# EAGLE design module_decode_opcodes (EAGLE 6.5.0)

## Sheet 1 of 11
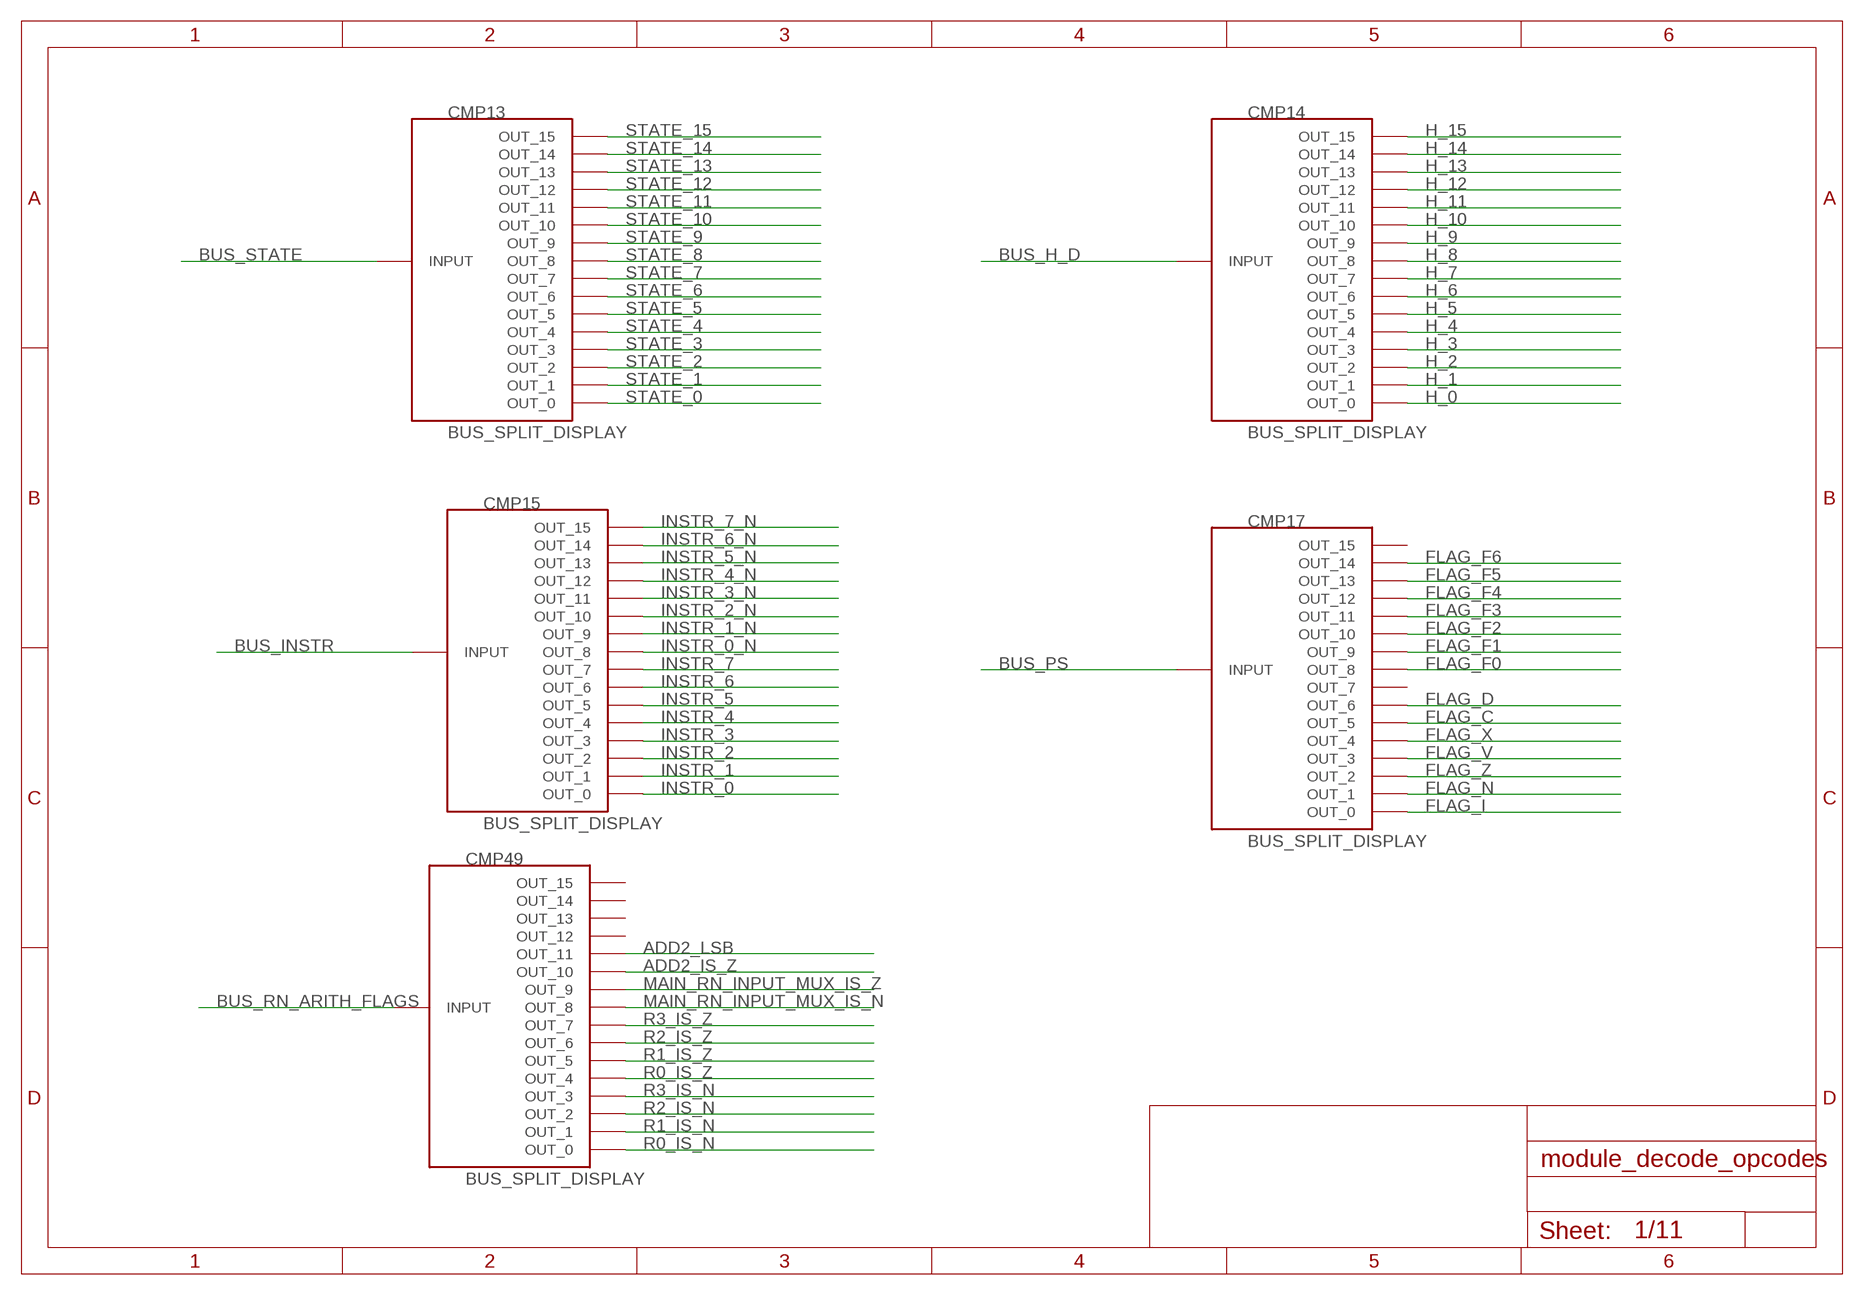
[diagram p0: schematic, sheet 1]

### Parts
CMP13  BUS_SPLIT_DISPLAY  [BUS_SPLIT_DISPLAY]
CMP14  BUS_SPLIT_DISPLAY  [BUS_SPLIT_DISPLAY]
CMP15  BUS_SPLIT_DISPLAY  [BUS_SPLIT_DISPLAY]
CMP17  BUS_SPLIT_DISPLAY  [BUS_SPLIT_DISPLAY]
CMP49  BUS_SPLIT_DISPLAY  [BUS_SPLIT_DISPLAY]

### Nets
ADD2_IS_Z: CMP49.P$11(OUT_10)
ADD2_LSB: CMP49.P$12(OUT_11)
BUS_H_D: CMP14.INPUT
BUS_INSTR: CMP15.INPUT
BUS_PS: CMP17.INPUT
BUS_RN_ARITH_FLAGS: CMP49.INPUT
BUS_STATE: CMP13.INPUT
FLAG_C: CMP17.P$6(OUT_5)
FLAG_D: CMP17.P$7(OUT_6)
FLAG_F0: CMP17.P$9(OUT_8)
FLAG_F1: CMP17.P$10(OUT_9)
FLAG_F2: CMP17.P$11(OUT_10)
FLAG_F3: CMP17.P$12(OUT_11)
FLAG_F4: CMP17.P$13(OUT_12)
FLAG_F5: CMP17.P$14(OUT_13)
FLAG_F6: CMP17.P$15(OUT_14) ; also sheet 6
FLAG_I: CMP17.P$1(OUT_0) ; also sheet 7
FLAG_N: CMP17.P$2(OUT_1)
FLAG_V: CMP17.P$4(OUT_3)
FLAG_X: CMP17.P$5(OUT_4)
FLAG_Z: CMP17.P$3(OUT_2)
H_0: CMP14.P$1(OUT_0) ; also sheet 6
H_1: CMP14.P$2(OUT_1) ; also sheet 6
H_2: CMP14.P$3(OUT_2) ; also sheet 6
H_3: CMP14.P$4(OUT_3) ; also sheet 6
H_4: CMP14.P$5(OUT_4) ; also sheet 6
H_5: CMP14.P$6(OUT_5)
H_6: CMP14.P$7(OUT_6) ; also sheet 5
H_7: CMP14.P$8(OUT_7) ; also sheet 5
H_8: CMP14.P$9(OUT_8)
H_9: CMP14.P$10(OUT_9)
H_10: CMP14.P$11(OUT_10)
H_11: CMP14.P$12(OUT_11)
H_12: CMP14.P$13(OUT_12)
H_13: CMP14.P$14(OUT_13)
H_14: CMP14.P$15(OUT_14)
H_15: CMP14.P$16(OUT_15)
INSTR_0: CMP15.P$1(OUT_0) ; also sheet 2,3,4
INSTR_0_N: CMP15.P$9(OUT_8)
INSTR_1: CMP15.P$2(OUT_1) ; also sheet 2,3,4
INSTR_1_N: CMP15.P$10(OUT_9)
INSTR_2: CMP15.P$3(OUT_2) ; also sheet 2,3,4,8
INSTR_2_N: CMP15.P$11(OUT_10) ; also sheet 8
INSTR_3: CMP15.P$4(OUT_3) ; also sheet 2,3,4
INSTR_3_N: CMP15.P$12(OUT_11) ; also sheet 4
INSTR_4: CMP15.P$5(OUT_4) ; also sheet 2,3
INSTR_4_N: CMP15.P$13(OUT_12)
INSTR_5: CMP15.P$6(OUT_5) ; also sheet 2,3
INSTR_5_N: CMP15.P$14(OUT_13)
INSTR_6: CMP15.P$7(OUT_6) ; also sheet 2,3,4
INSTR_6_N: CMP15.P$15(OUT_14) ; also sheet 8
INSTR_7: CMP15.P$8(OUT_7) ; also sheet 2,4,8
INSTR_7_N: CMP15.P$16(OUT_15) ; also sheet 3,7
MAIN_RN_INPUT_MUX_IS_N: CMP49.P$9(OUT_8)
MAIN_RN_INPUT_MUX_IS_Z: CMP49.P$10(OUT_9)
R0_IS_N: CMP49.P$1(OUT_0)
R0_IS_Z: CMP49.P$5(OUT_4)
R1_IS_N: CMP49.P$2(OUT_1)
R1_IS_Z: CMP49.P$6(OUT_5) ; also sheet 6
R2_IS_N: CMP49.P$3(OUT_2)
R2_IS_Z: CMP49.P$7(OUT_6)
R3_IS_N: CMP49.P$4(OUT_3)
R3_IS_Z: CMP49.P$8(OUT_7)
STATE_0: CMP13.P$1(OUT_0) ; also sheet 8
STATE_1: CMP13.P$2(OUT_1) ; also sheet 8
STATE_2: CMP13.P$3(OUT_2) ; also sheet 6
STATE_3: CMP13.P$4(OUT_3) ; also sheet 7
STATE_4: CMP13.P$5(OUT_4)
STATE_5: CMP13.P$6(OUT_5) ; also sheet 7
STATE_6: CMP13.P$7(OUT_6)
STATE_7: CMP13.P$8(OUT_7) ; also sheet 7
STATE_8: CMP13.P$9(OUT_8)
STATE_9: CMP13.P$10(OUT_9)
STATE_10: CMP13.P$11(OUT_10)
STATE_11: CMP13.P$12(OUT_11)
STATE_12: CMP13.P$13(OUT_12)
STATE_13: CMP13.P$14(OUT_13)
STATE_14: CMP13.P$15(OUT_14)
STATE_15: CMP13.P$16(OUT_15)
Unconnected: CMP17.P$8(OUT_7) CMP17.P$16(OUT_15) CMP49.P$13(OUT_12) CMP49.P$14(OUT_13) CMP49.P$15(OUT_14) CMP49.P$16(OUT_15)

## Sheet 2 of 11
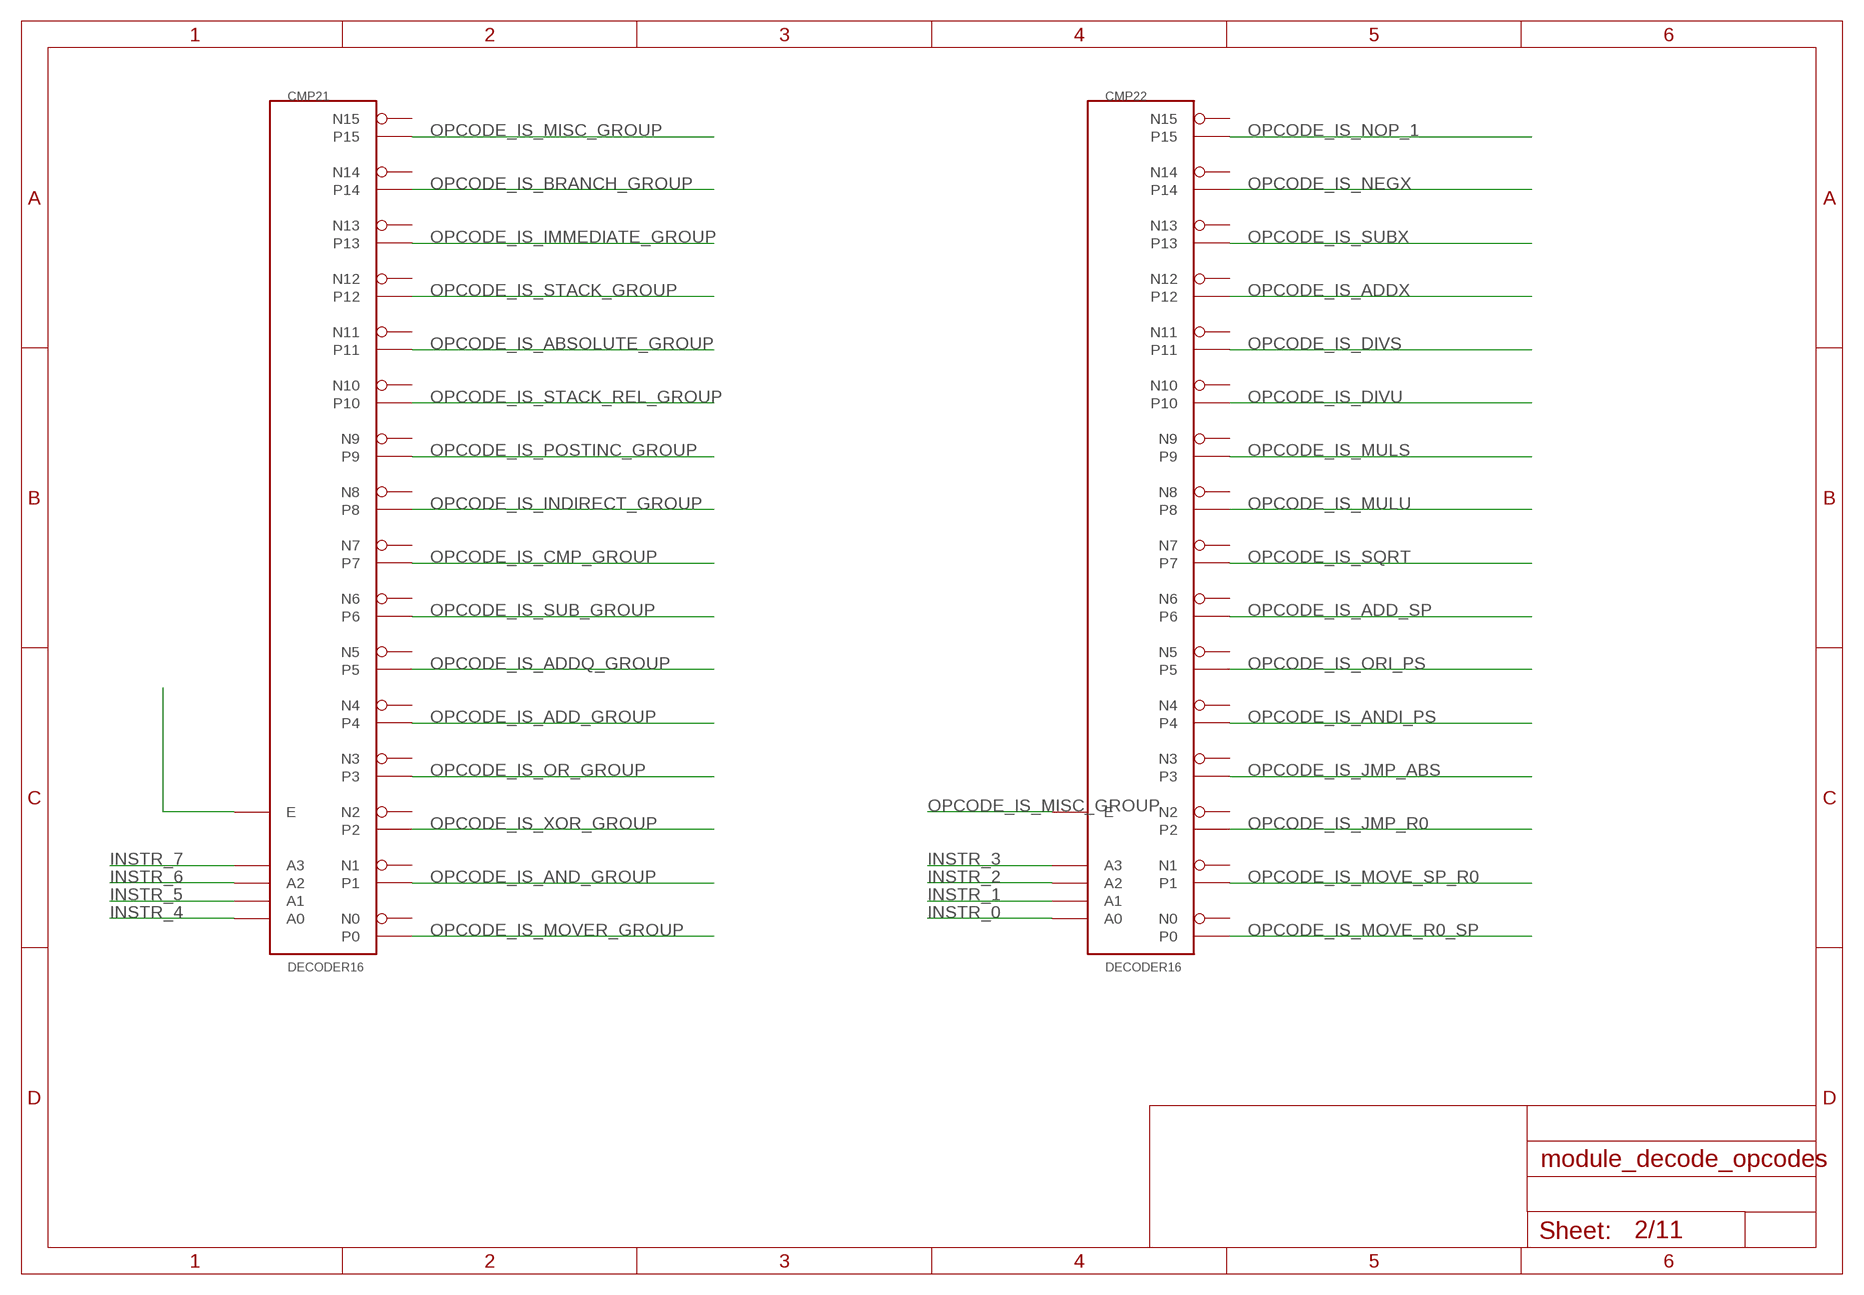
[diagram p1: schematic, sheet 2]

### Parts
CMP21  DECODER16  [DECODER16]
CMP22  DECODER16  [DECODER16]

### Nets
INSTR_0: CMP22.A0 ; also sheet 1,3,4
INSTR_1: CMP22.A1 ; also sheet 1,3,4
INSTR_2: CMP22.A2 ; also sheet 1,3,4,8
INSTR_3: CMP22.A3 ; also sheet 1,3,4
INSTR_4: CMP21.A0 ; also sheet 1,3
INSTR_5: CMP21.A1 ; also sheet 1,3
INSTR_6: CMP21.A2 ; also sheet 1,3,4
INSTR_7: CMP21.A3 ; also sheet 1,4,8
N$22: CMP21.E
OPCODE_IS_ABSOLUTE_GROUP: CMP21.P11 ; also sheet 9
OPCODE_IS_ADD_GROUP: CMP21.P4 ; also sheet 9
OPCODE_IS_ADD_SP: CMP22.P6 ; also sheet 9
OPCODE_IS_ADDQ_GROUP: CMP21.P5 ; also sheet 9
OPCODE_IS_ADDX: CMP22.P12 ; also sheet 5,9
OPCODE_IS_AND_GROUP: CMP21.P1 ; also sheet 9
OPCODE_IS_ANDI_PS: CMP22.P4 ; also sheet 9
OPCODE_IS_BRANCH_GROUP: CMP21.P14 ; also sheet 9
OPCODE_IS_CMP_GROUP: CMP21.P7 ; also sheet 9
OPCODE_IS_DIVS: CMP22.P11 ; also sheet 5,9
OPCODE_IS_DIVU: CMP22.P10 ; also sheet 5
OPCODE_IS_IMMEDIATE_GROUP: CMP21.P13 ; also sheet 4
OPCODE_IS_INDIRECT_GROUP: CMP21.P8 ; also sheet 6,9
OPCODE_IS_JMP_ABS: CMP22.P3 ; also sheet 9
OPCODE_IS_JMP_R0: CMP22.P2 ; also sheet 9
OPCODE_IS_MISC_GROUP: CMP21.P15 CMP22.E
OPCODE_IS_MOVE_R0_SP: CMP22.P0 ; also sheet 9
OPCODE_IS_MOVE_SP_R0: CMP22.P1 ; also sheet 9
OPCODE_IS_MOVER_GROUP: CMP21.P0
OPCODE_IS_MULS: CMP22.P9 ; also sheet 5,9
OPCODE_IS_MULU: CMP22.P8 ; also sheet 5,9
OPCODE_IS_NEGX: CMP22.P14 ; also sheet 5,9
OPCODE_IS_NOP_1: CMP22.P15 ; also sheet 5
OPCODE_IS_OR_GROUP: CMP21.P3 ; also sheet 9
OPCODE_IS_ORI_PS: CMP22.P5 ; also sheet 9
OPCODE_IS_POSTINC_GROUP: CMP21.P9 ; also sheet 6,9
OPCODE_IS_SQRT: CMP22.P7 ; also sheet 5,9
OPCODE_IS_STACK_GROUP: CMP21.P12 ; also sheet 3,4,9
OPCODE_IS_STACK_REL_GROUP: CMP21.P10 ; also sheet 7,9
OPCODE_IS_SUB_GROUP: CMP21.P6 ; also sheet 9
OPCODE_IS_SUBX: CMP22.P13 ; also sheet 5,9
OPCODE_IS_XOR_GROUP: CMP21.P2 ; also sheet 9
Unconnected: CMP21.N0 CMP21.N1 CMP21.N2 CMP21.N3 CMP21.N4 CMP21.N5 CMP21.N6 CMP21.N7 CMP21.N8 CMP21.N9 CMP21.N10 CMP21.N11 CMP21.N12 CMP21.N13 CMP21.N14 CMP21.N15 CMP22.N0 CMP22.N1 CMP22.N2 CMP22.N3 CMP22.N4 CMP22.N5 CMP22.N6 CMP22.N7 CMP22.N8 CMP22.N9 CMP22.N10 CMP22.N11 CMP22.N12 CMP22.N13 CMP22.N14 CMP22.N15

## Sheet 3 of 11
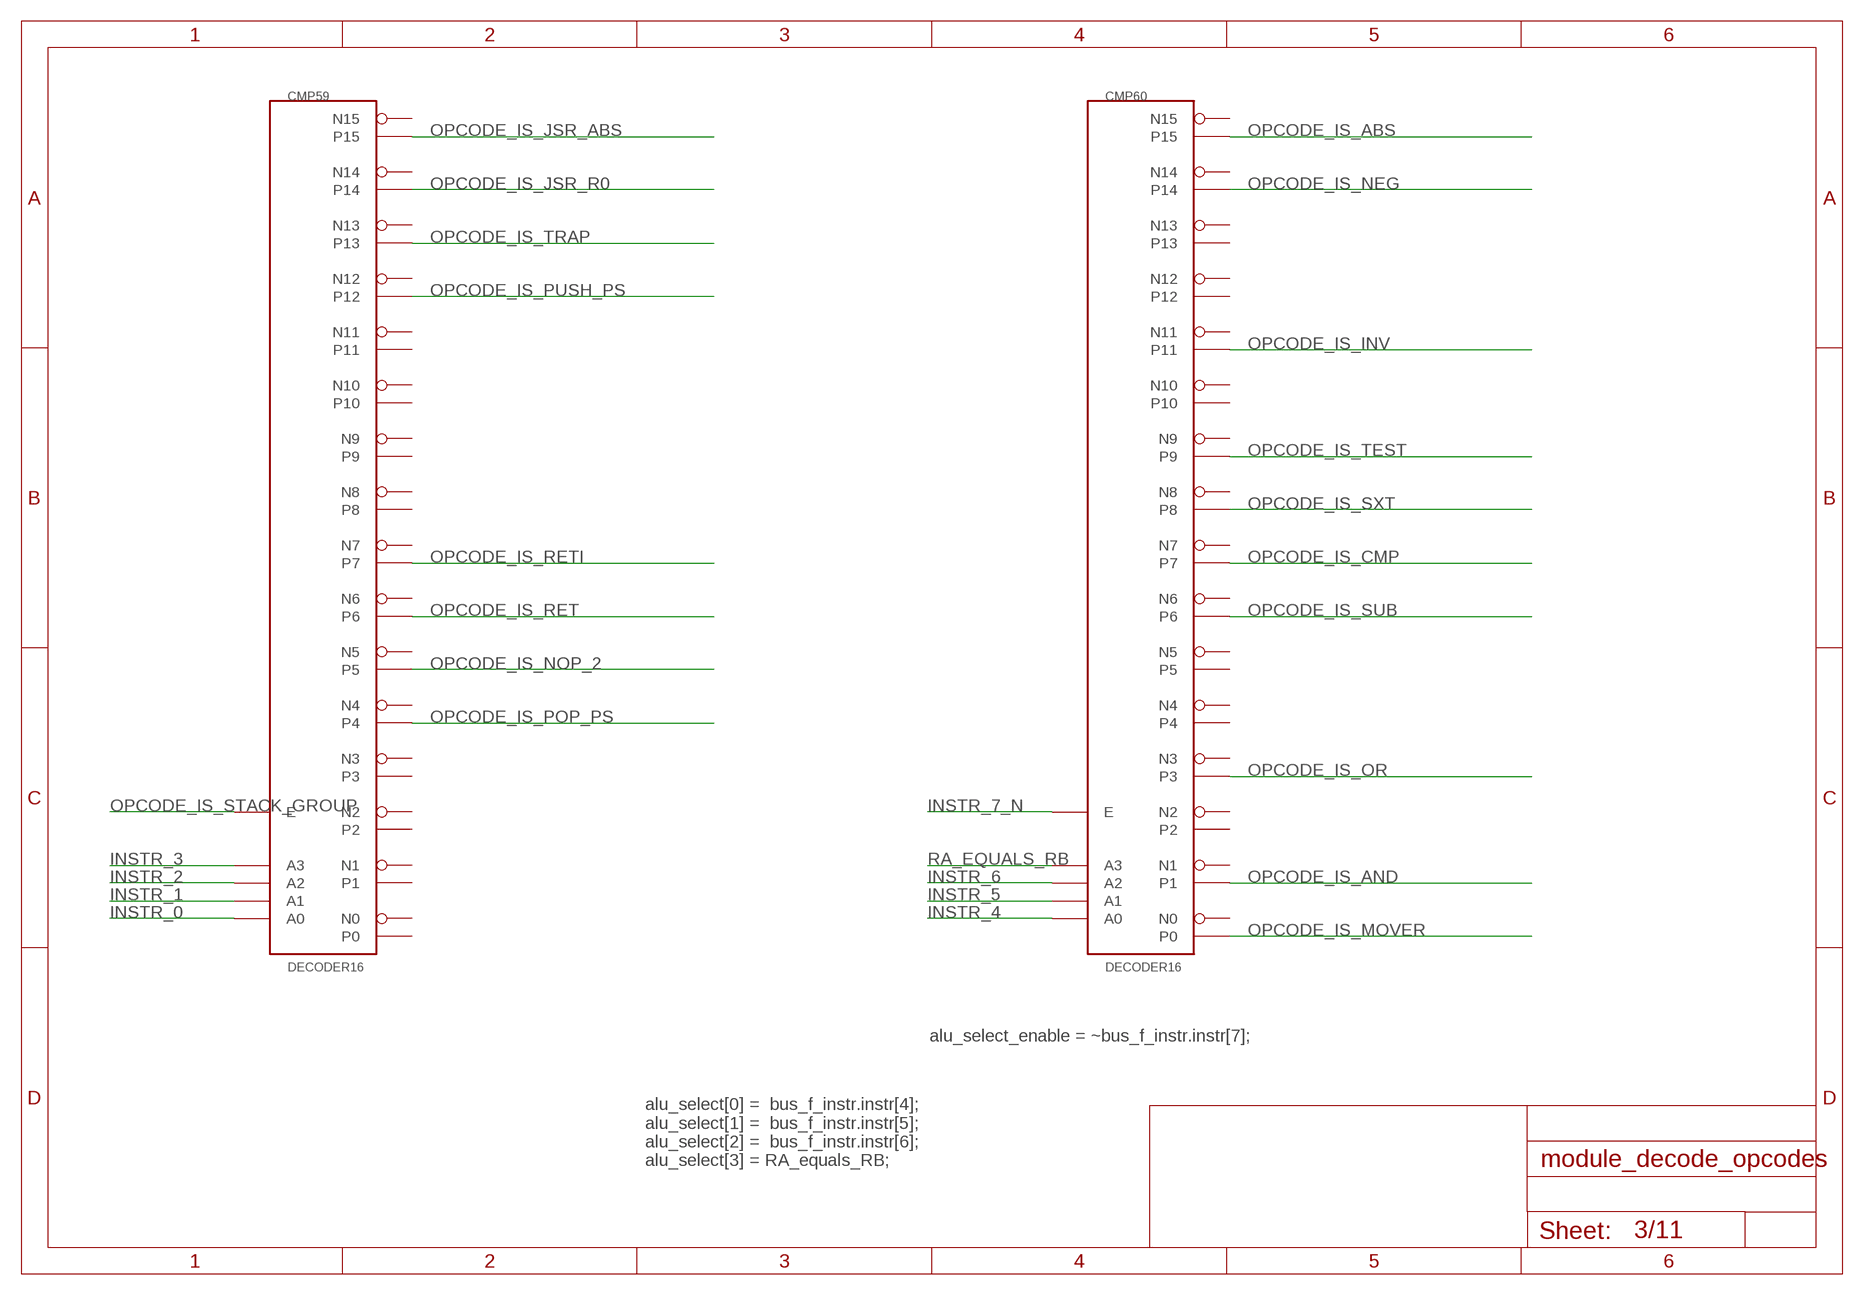
[diagram p2: schematic, sheet 3]

### Parts
CMP59  DECODER16  [DECODER16]
CMP60  DECODER16  [DECODER16]

### Nets
INSTR_0: CMP59.A0 ; also sheet 1,2,4
INSTR_1: CMP59.A1 ; also sheet 1,2,4
INSTR_2: CMP59.A2 ; also sheet 1,2,4,8
INSTR_3: CMP59.A3 ; also sheet 1,2,4
INSTR_4: CMP60.A0 ; also sheet 1,2
INSTR_5: CMP60.A1 ; also sheet 1,2
INSTR_6: CMP60.A2 ; also sheet 1,2,4
INSTR_7_N: CMP60.E ; also sheet 1,7
OPCODE_IS_ABS: CMP60.P15 ; also sheet 10
OPCODE_IS_AND: CMP60.P1
OPCODE_IS_CMP: CMP60.P7 ; also sheet 10
OPCODE_IS_INV: CMP60.P11 ; also sheet 10
OPCODE_IS_JSR_ABS: CMP59.P15 ; also sheet 5,10
OPCODE_IS_JSR_R0: CMP59.P14 ; also sheet 5,10
OPCODE_IS_MOVER: CMP60.P0 ; also sheet 10
OPCODE_IS_NEG: CMP60.P14 ; also sheet 10
OPCODE_IS_NOP_2: CMP59.P5 ; also sheet 5
OPCODE_IS_OR: CMP60.P3 ; also sheet 10
OPCODE_IS_POP_PS: CMP59.P4 ; also sheet 7,10
OPCODE_IS_PUSH_PS: CMP59.P12 ; also sheet 7,10
OPCODE_IS_RET: CMP59.P6 ; also sheet 10
OPCODE_IS_RETI: CMP59.P7 ; also sheet 10
OPCODE_IS_STACK_GROUP: CMP59.E ; also sheet 2,4,9
OPCODE_IS_SUB: CMP60.P6 ; also sheet 10
OPCODE_IS_SXT: CMP60.P8 ; also sheet 10
OPCODE_IS_TEST: CMP60.P9 ; also sheet 10
OPCODE_IS_TRAP: CMP59.P13 ; also sheet 7,10
RA_EQUALS_RB: CMP60.A3 ; also sheet 4
Unconnected: CMP59.N0 CMP59.N1 CMP59.N2 CMP59.N3 CMP59.N4 CMP59.N5 CMP59.N6 CMP59.N7 CMP59.N8 CMP59.N9 CMP59.N10 CMP59.N11 CMP59.N12 CMP59.N13 CMP59.N14 CMP59.N15 CMP59.P0 CMP59.P1 CMP59.P2 CMP59.P3 CMP59.P8 CMP59.P9 CMP59.P10 CMP59.P11 CMP60.N0 CMP60.N1 CMP60.N2 CMP60.N3 CMP60.N4 CMP60.N5 CMP60.N6 CMP60.N7 CMP60.N8 CMP60.N9 CMP60.N10 CMP60.N11 CMP60.N12 CMP60.N13 CMP60.N14 CMP60.N15 CMP60.P2 CMP60.P4 CMP60.P5 CMP60.P10 CMP60.P12 CMP60.P13

### Notes on the sheet
- alu_select_enable = ~bus_f_instr.instr[7];
- alu_select[0] =  bus_f_instr.instr[4];
      alu_select[1] =  bus_f_instr.instr[5];
      alu_select[2] =  bus_f_instr.instr[6];
      alu_select[3] = RA_equals_RB;

## Sheet 4 of 11
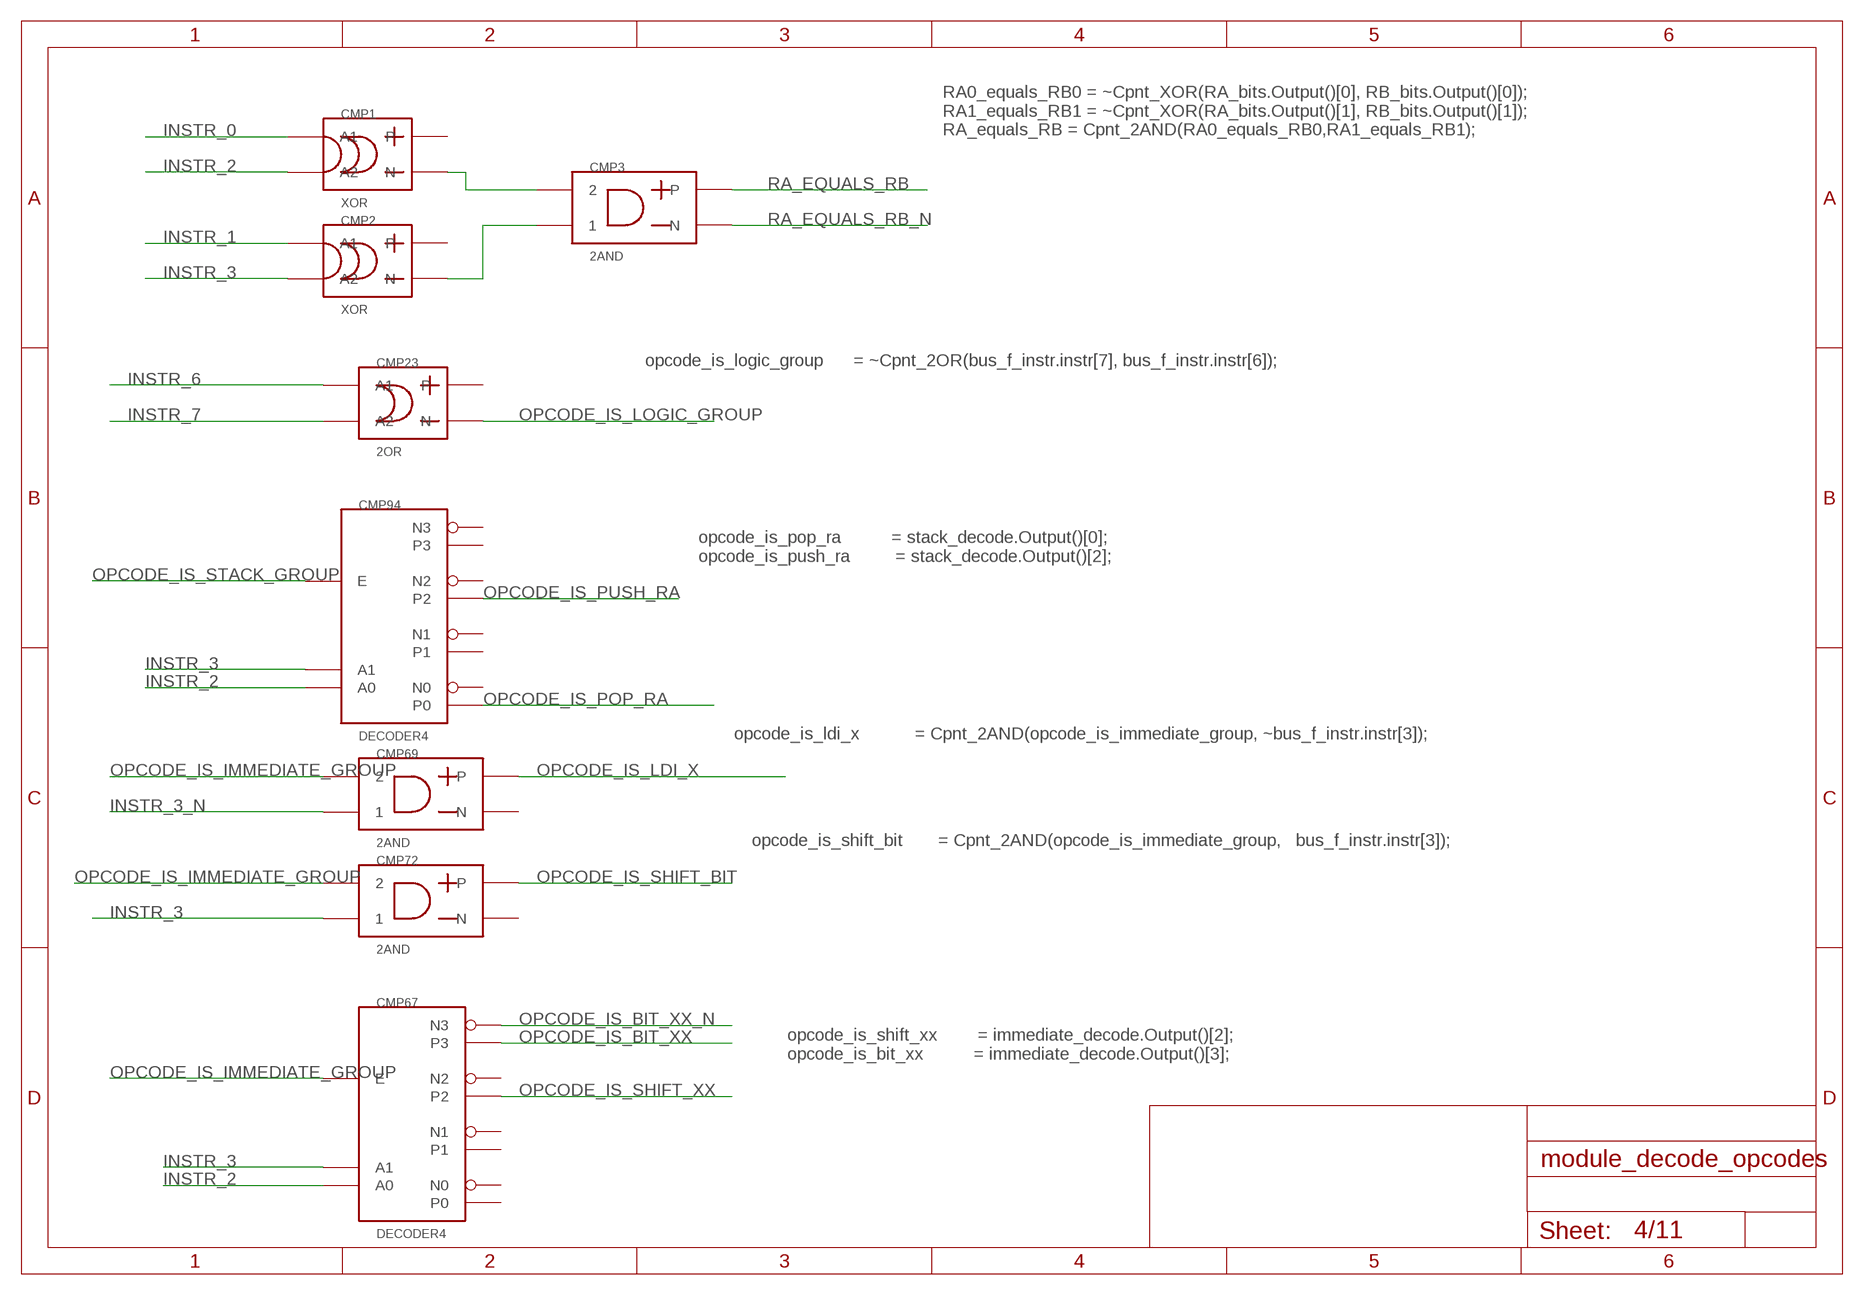
[diagram p3: schematic, sheet 4]

### Parts
CMP1  XOR  [XOR]
CMP2  XOR  [XOR]
CMP3  2AND  [2AND]
CMP23  2OR  [2OR]
CMP67  DECODER4  [DECODER4]
CMP69  2AND  [2AND]
CMP72  2AND  [2AND]
CMP94  DECODER4  [DECODER4]

### Nets
INSTR_0: CMP1.P$1(A1) ; also sheet 1,2,3
INSTR_1: CMP2.P$1(A1) ; also sheet 1,2,3
INSTR_2: CMP1.P$2(A2) CMP67.A0 CMP94.A0 ; also sheet 1,2,3,8
INSTR_3: CMP2.P$2(A2) CMP67.A1 CMP72.P$1 CMP94.A1 ; also sheet 1,2,3
INSTR_3_N: CMP69.P$1 ; also sheet 1
INSTR_6: CMP23.P$2(A1) ; also sheet 1,2,3
INSTR_7: CMP23.P$1(A2) ; also sheet 1,2,8
N$6: CMP1.OUT_N(N) CMP3.P$2
N$7: CMP2.OUT_N(N) CMP3.P$1
OPCODE_IS_BIT_XX: CMP67.P3 ; also sheet 10
OPCODE_IS_BIT_XX_N: CMP67.N3 ; also sheet 10
OPCODE_IS_IMMEDIATE_GROUP: CMP67.E CMP69.P$2 CMP72.P$2 ; also sheet 2
OPCODE_IS_LDI_X: CMP69.OUT_P(P) ; also sheet 8,10
OPCODE_IS_LOGIC_GROUP: CMP23.OUT_M(N) ; also sheet 9
OPCODE_IS_POP_RA: CMP94.P0 ; also sheet 7,8,10
OPCODE_IS_PUSH_RA: CMP94.P2 ; also sheet 7,8,10
OPCODE_IS_SHIFT_BIT: CMP72.OUT_P(P) ; also sheet 10
OPCODE_IS_SHIFT_XX: CMP67.P2 ; also sheet 6,10
OPCODE_IS_STACK_GROUP: CMP94.E ; also sheet 2,3,9
RA_EQUALS_RB: CMP3.OUT_P(P) ; also sheet 3
RA_EQUALS_RB_N: CMP3.OUT_M(N)
Unconnected: CMP1.OUT_P(P) CMP2.OUT_P(P) CMP23.OUT_P(P) CMP67.N0 CMP67.N1 CMP67.N2 CMP67.P0 CMP67.P1 CMP69.OUT_M(N) CMP72.OUT_M(N) CMP94.N0 CMP94.N1 CMP94.N2 CMP94.N3 CMP94.P1 CMP94.P3

### Notes on the sheet
- RA0_equals_RB0 = ~Cpnt_XOR(RA_bits.Output()[0], RB_bits.Output()[0]);
     RA1_equals_RB1 = ~Cpnt_XOR(RA_bits.Output()[1], RB_bits.Output()[1]);
     RA_equals_RB = Cpnt_2AND(RA0_equals_RB0,RA1_equals_RB1);
- opcode_is_logic_group      = ~Cpnt_2OR(bus_f_instr.instr[7], bus_f_instr.instr[6]);
- opcode_is_pop_ra          = stack_decode.Output()[0];
      opcode_is_push_ra         = stack_decode.Output()[2];
- opcode_is_ldi_x           = Cpnt_2AND(opcode_is_immediate_group, ~bus_f_instr.instr[3]);
- opcode_is_shift_bit       = Cpnt_2AND(opcode_is_immediate_group,   bus_f_instr.instr[3]);
- opcode_is_shift_xx        = immediate_decode.Output()[2];
      opcode_is_bit_xx          = immediate_decode.Output()[3];

## Sheet 5 of 11
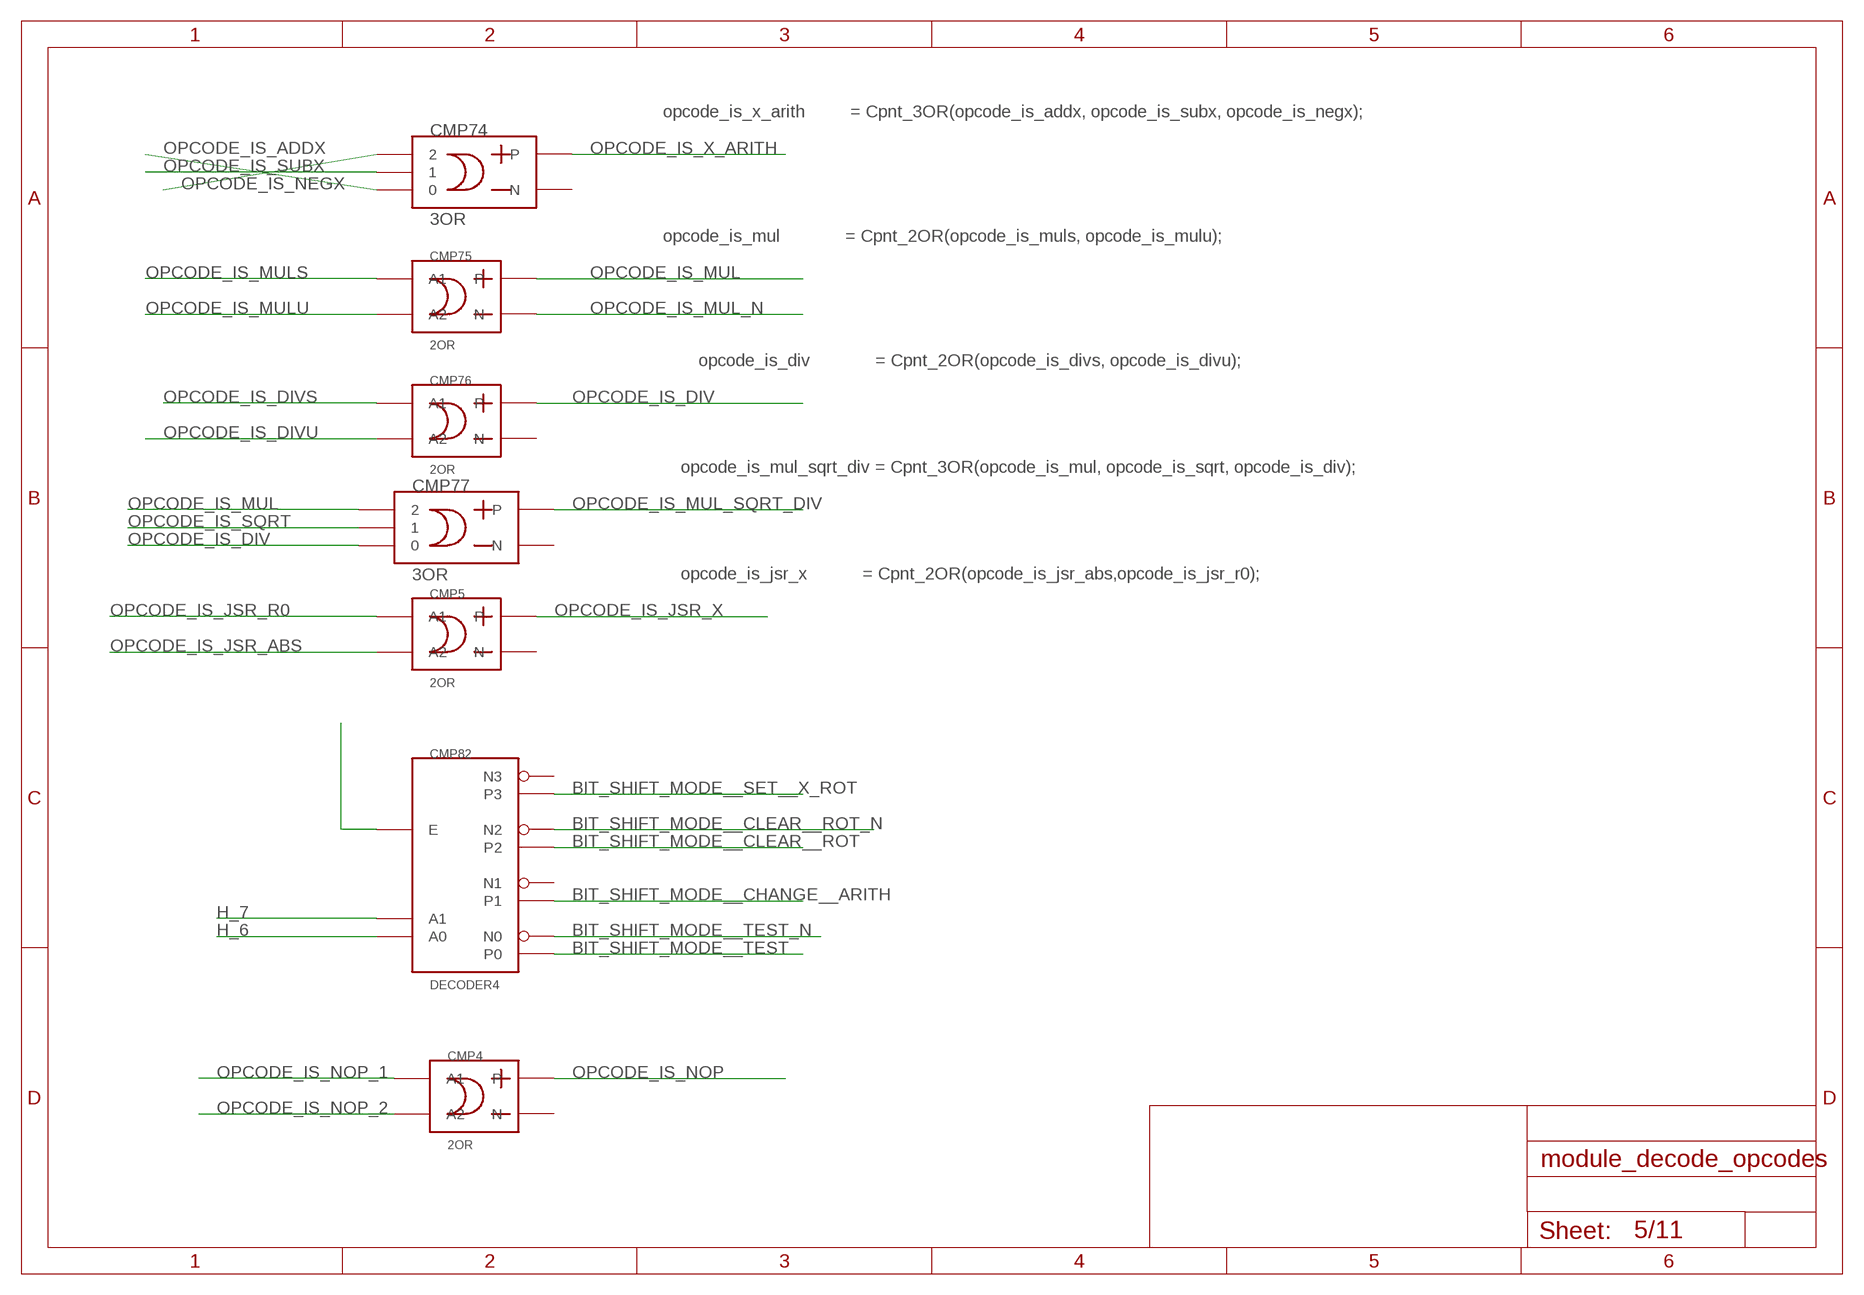
[diagram p4: schematic, sheet 5]

### Parts
CMP4  2OR  [2OR]
CMP5  2OR  [2OR]
CMP74  3OR  [3OR]
CMP75  2OR  [2OR]
CMP76  2OR  [2OR]
CMP77  3OR  [3OR]
CMP82  DECODER4  [DECODER4]

### Nets
BIT_SHIFT_MODE__CHANGE__ARITH: CMP82.P1 ; also sheet 10
BIT_SHIFT_MODE__CLEAR__ROT: CMP82.P2
BIT_SHIFT_MODE__CLEAR__ROT_N: CMP82.N2 ; also sheet 10
BIT_SHIFT_MODE__SET__X_ROT: CMP82.P3 ; also sheet 10
BIT_SHIFT_MODE__TEST: CMP82.P0
BIT_SHIFT_MODE__TEST_N: CMP82.N0 ; also sheet 10
H_6: CMP82.A0 ; also sheet 1
H_7: CMP82.A1 ; also sheet 1
N$26: CMP82.E
OPCODE_IS_ADDX: CMP74.P$1 ; also sheet 2,9
OPCODE_IS_DIV: CMP76.OUT_P(P) CMP77.P$1 ; also sheet 6,9
OPCODE_IS_DIVS: CMP76.P$2(A1) ; also sheet 2,9
OPCODE_IS_DIVU: CMP76.P$1(A2) ; also sheet 2
OPCODE_IS_JSR_ABS: CMP5.P$1(A2) ; also sheet 3,10
OPCODE_IS_JSR_R0: CMP5.P$2(A1) ; also sheet 3,10
OPCODE_IS_JSR_X: CMP5.OUT_P(P) ; also sheet 11
OPCODE_IS_MUL: CMP75.OUT_P(P) CMP77.P$3
OPCODE_IS_MUL_N: CMP75.OUT_M(N) ; also sheet 9
OPCODE_IS_MUL_SQRT_DIV: CMP77.OUT_P(P) ; also sheet 10
OPCODE_IS_MULS: CMP75.P$2(A1) ; also sheet 2,9
OPCODE_IS_MULU: CMP75.P$1(A2) ; also sheet 2,9
OPCODE_IS_NEGX: CMP74.P$3 ; also sheet 2,9
OPCODE_IS_NOP: CMP4.OUT_P(P) ; also sheet 7,10
OPCODE_IS_NOP_1: CMP4.P$2(A1) ; also sheet 2
OPCODE_IS_NOP_2: CMP4.P$1(A2) ; also sheet 3
OPCODE_IS_SQRT: CMP77.P$2 ; also sheet 2,9
OPCODE_IS_SUBX: CMP74.P$2 ; also sheet 2,9
OPCODE_IS_X_ARITH: CMP74.OUT_P(P) ; also sheet 7,10
Unconnected: CMP4.OUT_M(N) CMP5.OUT_M(N) CMP74.OUT_M(N) CMP76.OUT_M(N) CMP77.OUT_M(N) CMP82.N1 CMP82.N3

### Notes on the sheet
- opcode_is_x_arith         = Cpnt_3OR(opcode_is_addx, opcode_is_subx, opcode_is_negx);
- opcode_is_mul             = Cpnt_2OR(opcode_is_muls, opcode_is_mulu);
- opcode_is_div             = Cpnt_2OR(opcode_is_divs, opcode_is_divu);
- opcode_is_mul_sqrt_div = Cpnt_3OR(opcode_is_mul, opcode_is_sqrt, opcode_is_div);
- opcode_is_jsr_x           = Cpnt_2OR(opcode_is_jsr_abs,opcode_is_jsr_r0);

## Sheet 6 of 11
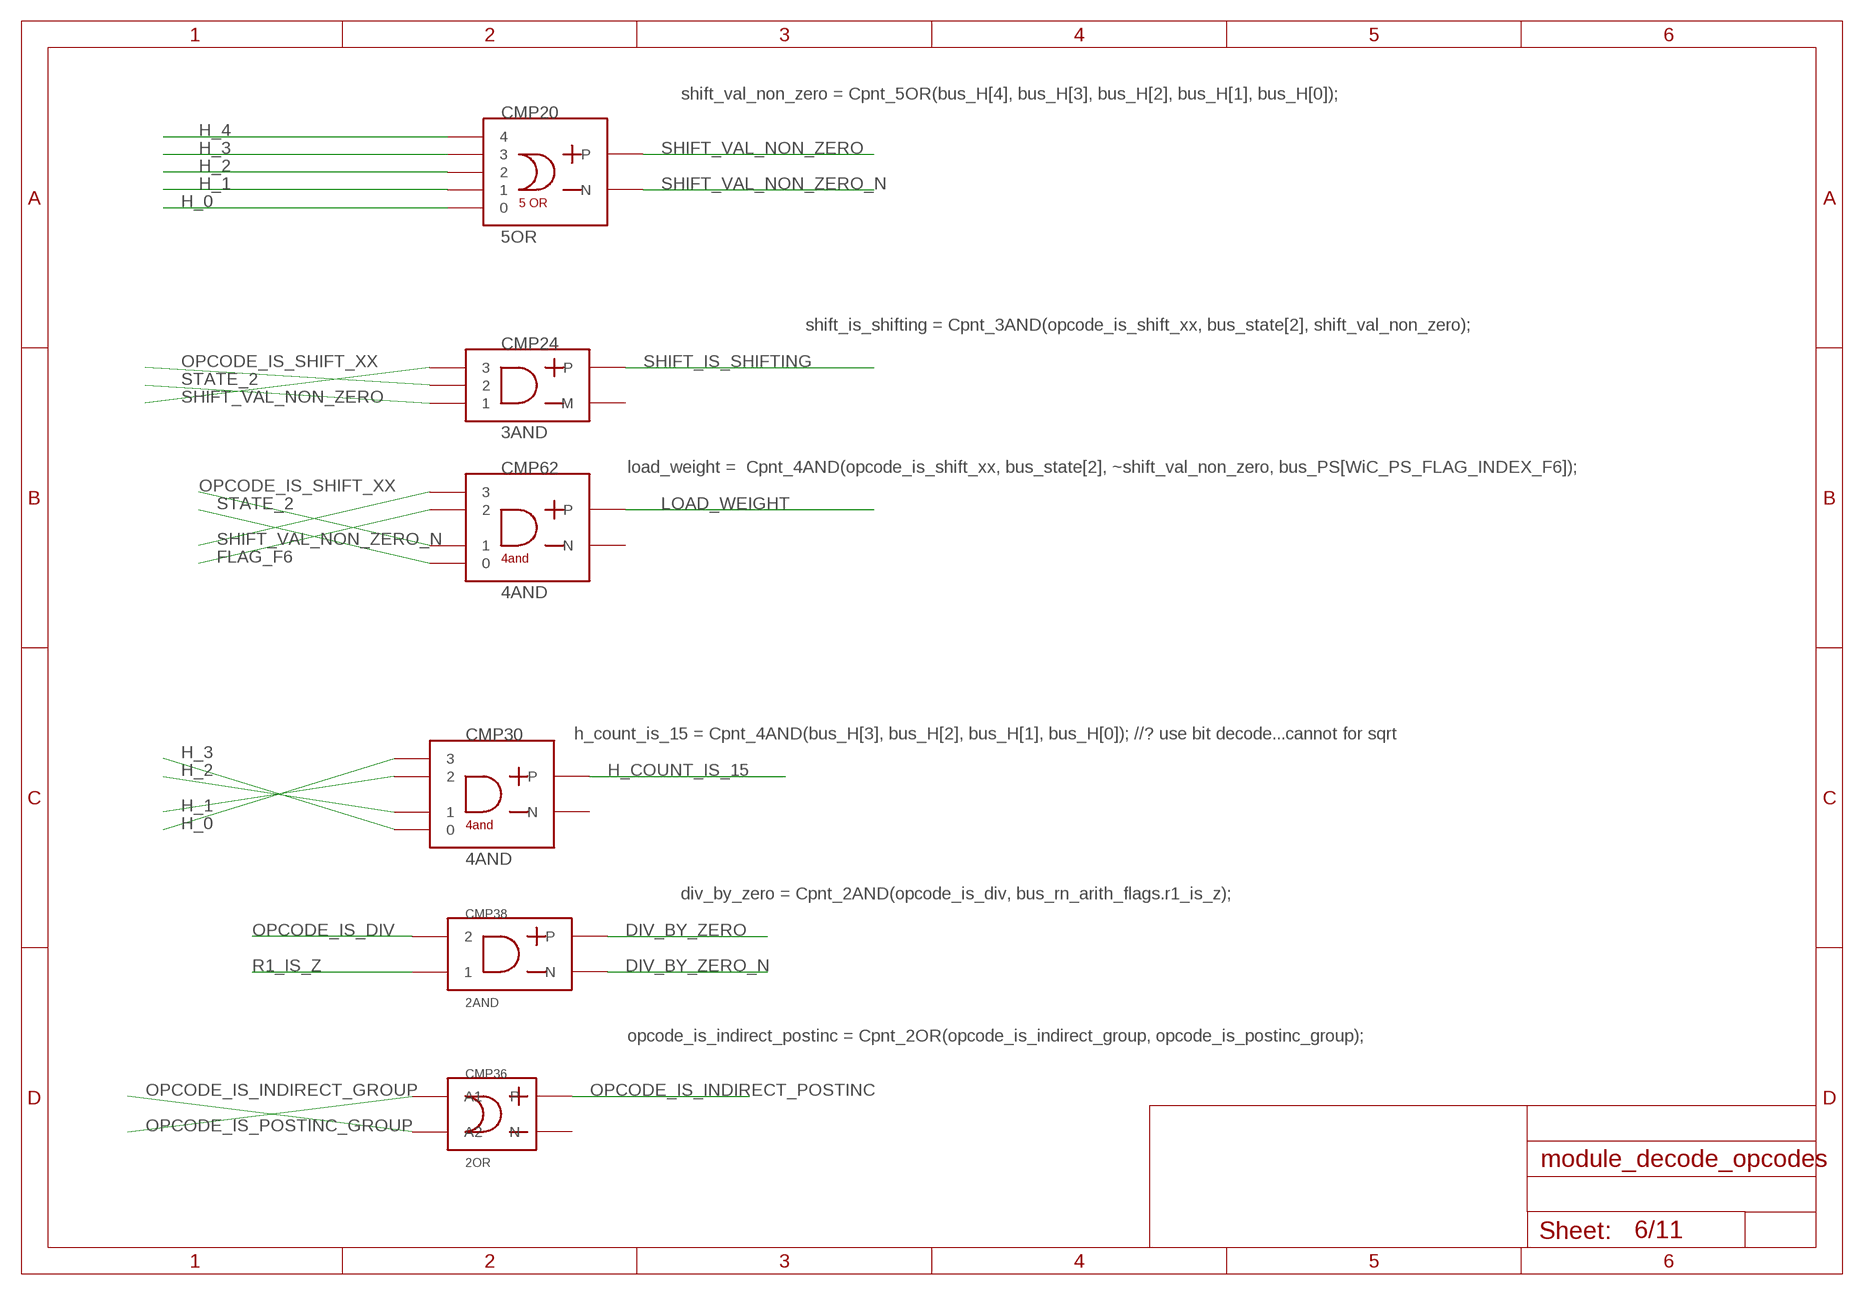
[diagram p5: schematic, sheet 6]

### Parts
CMP20  5OR  [5OR]
CMP24  3AND  [3AND]
CMP30  4AND  [4AND]
CMP36  2OR  [2OR]
CMP38  2AND  [2AND]
CMP62  4AND  [4AND]

### Nets
DIV_BY_ZERO: CMP38.OUT_P(P) ; also sheet 10
DIV_BY_ZERO_N: CMP38.OUT_M(N) ; also sheet 10
FLAG_F6: CMP62.P$3 ; also sheet 1
H_0: CMP20.1 CMP30.P$4 ; also sheet 1
H_1: CMP20.2 CMP30.P$3 ; also sheet 1
H_2: CMP20.3 CMP30.P$2 ; also sheet 1
H_3: CMP20.4 CMP30.P$1 ; also sheet 1
H_4: CMP20.5 ; also sheet 1
H_COUNT_IS_15: CMP30.OUT_P(P) ; also sheet 11
LOAD_WEIGHT: CMP62.OUT_P(P) ; also sheet 11
OPCODE_IS_DIV: CMP38.P$2 ; also sheet 5,9
OPCODE_IS_INDIRECT_GROUP: CMP36.P$1(A2) ; also sheet 2,9
OPCODE_IS_INDIRECT_POSTINC: CMP36.OUT_P(P) ; also sheet 7,9
OPCODE_IS_POSTINC_GROUP: CMP36.P$2(A1) ; also sheet 2,9
OPCODE_IS_SHIFT_XX: CMP24.P$2 CMP62.P$2 ; also sheet 4,10
R1_IS_Z: CMP38.P$1 ; also sheet 1
SHIFT_IS_SHIFTING: CMP24.OUT_P(P) ; also sheet 11
SHIFT_VAL_NON_ZERO: CMP20.OUT_P(P) CMP24.P$3 ; also sheet 11
SHIFT_VAL_NON_ZERO_N: CMP20.OUT_M(N) CMP62.P$4 ; also sheet 11
STATE_2: CMP24.P$1 CMP62.P$1 ; also sheet 1
Unconnected: CMP24.OUT_M(M) CMP30.OUT_M(N) CMP36.OUT_M(N) CMP62.OUT_M(N)

### Notes on the sheet
- shift_val_non_zero = Cpnt_5OR(bus_H[4], bus_H[3], bus_H[2], bus_H[1], bus_H[0]);
- shift_is_shifting = Cpnt_3AND(opcode_is_shift_xx, bus_state[2], shift_val_non_zero);
- load_weight =  Cpnt_4AND(opcode_is_shift_xx, bus_state[2], ~shift_val_non_zero, bus_PS[WiC_PS_FLAG_INDEX_F6]);
- h_count_is_15 = Cpnt_4AND(bus_H[3], bus_H[2], bus_H[1], bus_H[0]); //? use bit decode...cannot for sqrt
- div_by_zero = Cpnt_2AND(opcode_is_div, bus_rn_arith_flags.r1_is_z);
- opcode_is_indirect_postinc = Cpnt_2OR(opcode_is_indirect_group, opcode_is_postinc_group);

## Sheet 7 of 11
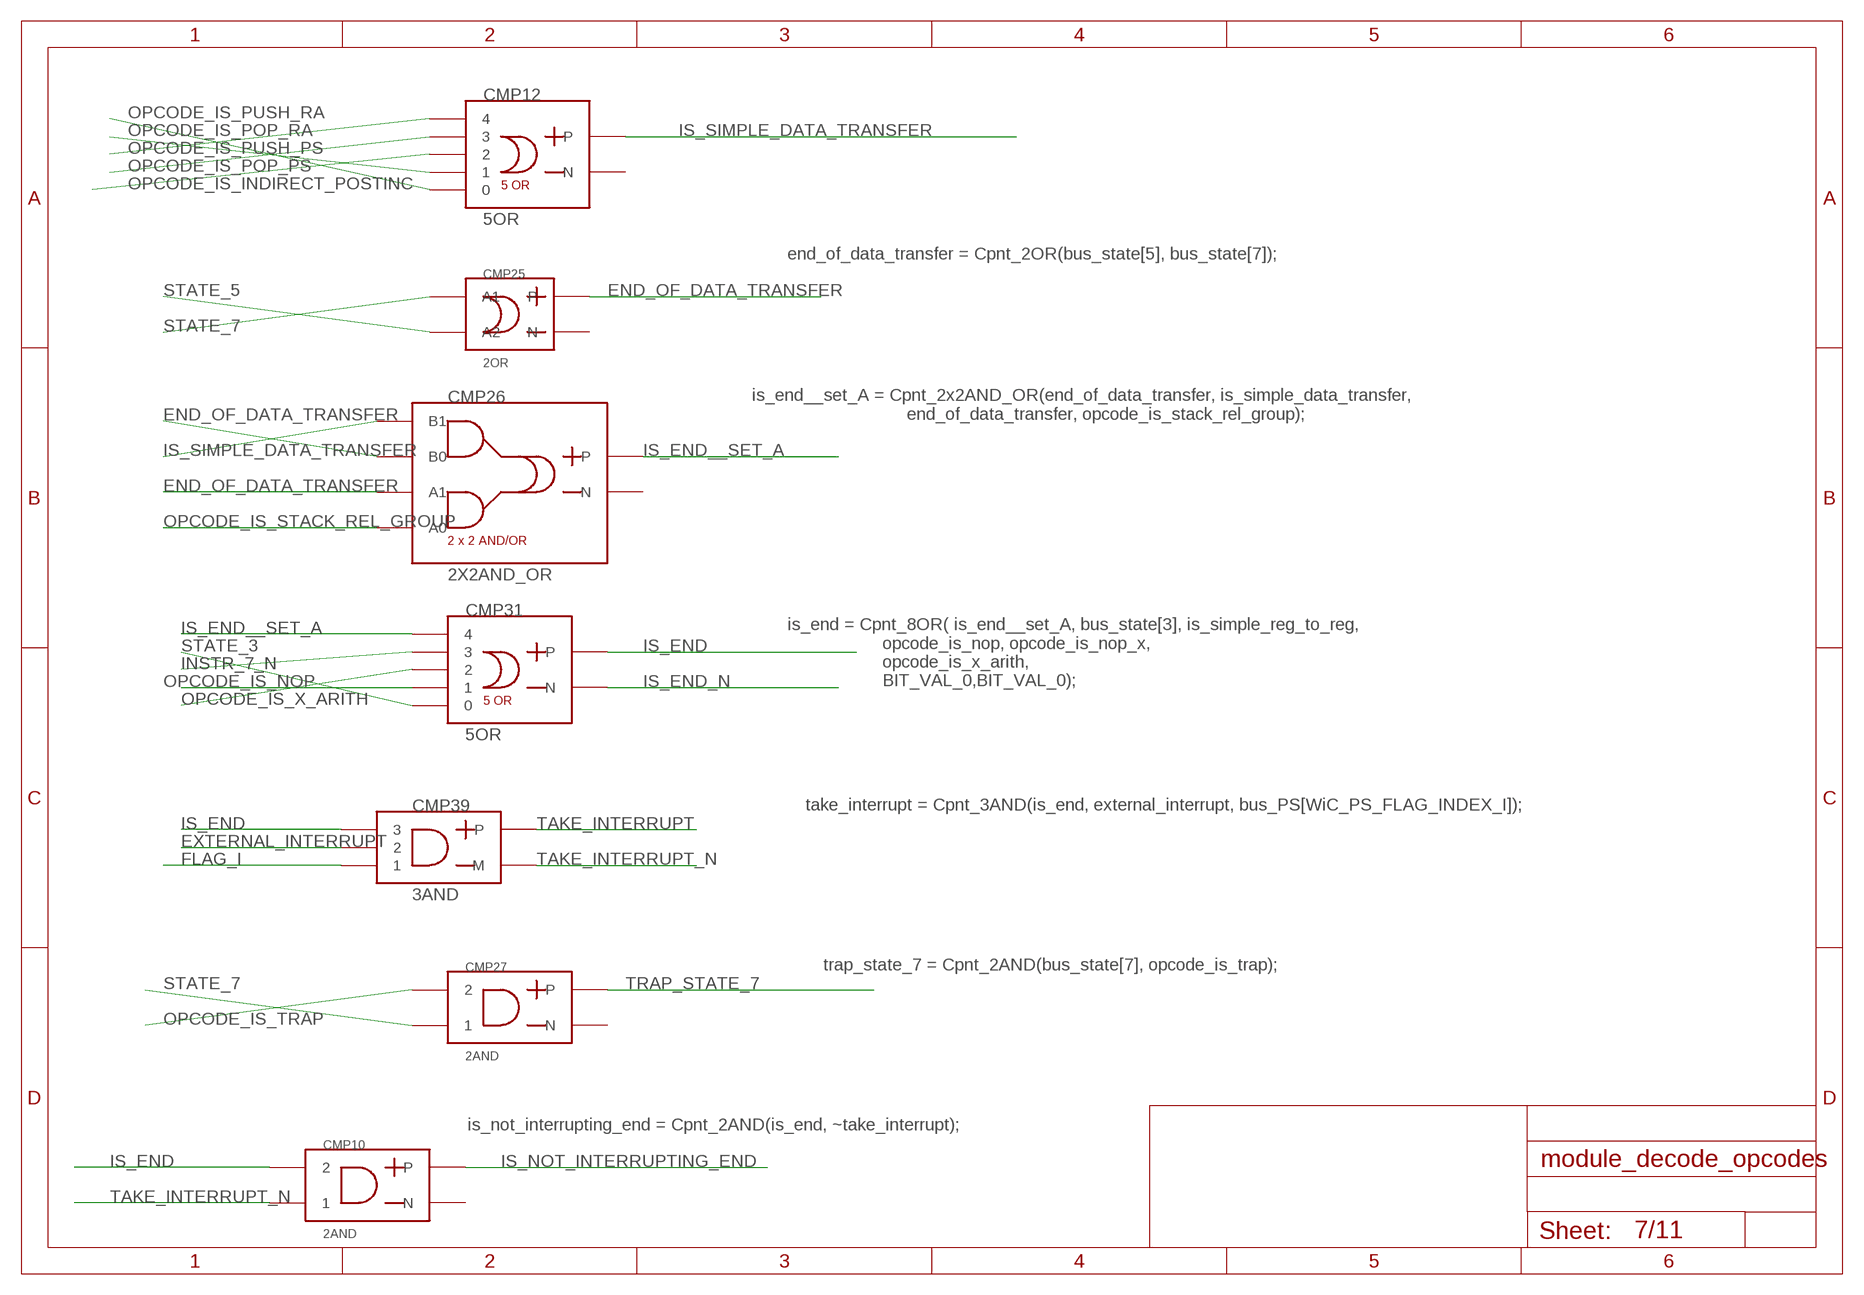
[diagram p6: schematic, sheet 7]

### Parts
CMP10  2AND  [2AND]
CMP12  5OR  [5OR]
CMP25  2OR  [2OR]
CMP26  2X2AND_OR  [2X2AND_OR]
CMP27  2AND  [2AND]
CMP31  5OR  [5OR]
CMP39  3AND  [3AND]

### Nets
END_OF_DATA_TRANSFER: CMP25.OUT_P(P) CMP26.P$2(A1) CMP26.P$3(B0)
EXTERNAL_INTERRUPT: CMP39.P$2
FLAG_I: CMP39.P$1 ; also sheet 1
INSTR_7_N: CMP31.4 ; also sheet 1,3
IS_END: CMP10.P$2 CMP31.OUT_P(P) CMP39.P$3 ; also sheet 11
IS_END__SET_A: CMP26.OUT_P(P) CMP31.5
IS_END_N: CMP31.OUT_M(N) ; also sheet 11
IS_NOT_INTERRUPTING_END: CMP10.OUT_P(P) ; also sheet 11
IS_SIMPLE_DATA_TRANSFER: CMP12.OUT_P(P) CMP26.P$4(B1) ; also sheet 11
OPCODE_IS_INDIRECT_POSTINC: CMP12.3 ; also sheet 6,9
OPCODE_IS_NOP: CMP31.2 ; also sheet 5,10
OPCODE_IS_POP_PS: CMP12.4 ; also sheet 3,10
OPCODE_IS_POP_RA: CMP12.2 ; also sheet 4,8,10
OPCODE_IS_PUSH_PS: CMP12.5 ; also sheet 3,10
OPCODE_IS_PUSH_RA: CMP12.1 ; also sheet 4,8,10
OPCODE_IS_STACK_REL_GROUP: CMP26.P$1(A0) ; also sheet 2,9
OPCODE_IS_TRAP: CMP27.P$2 ; also sheet 3,10
OPCODE_IS_X_ARITH: CMP31.3 ; also sheet 5,10
STATE_3: CMP31.1 ; also sheet 1
STATE_5: CMP25.P$1(A2) ; also sheet 1
STATE_7: CMP25.P$2(A1) CMP27.P$1 ; also sheet 1
TAKE_INTERRUPT: CMP39.OUT_P(P) ; also sheet 11
TAKE_INTERRUPT_N: CMP10.P$1 CMP39.OUT_M(M)
TRAP_STATE_7: CMP27.OUT_P(P) ; also sheet 11
Unconnected: CMP10.OUT_M(N) CMP12.OUT_M(N) CMP25.OUT_M(N) CMP26.OUT_M(N) CMP27.OUT_M(N)

### Notes on the sheet
- end_of_data_transfer = Cpnt_2OR(bus_state[5], bus_state[7]);
- is_end__set_A = Cpnt_2x2AND_OR(end_of_data_transfer, is_simple_data_transfer,
                                     end_of_data_transfer, opcode_is_stack_rel_group);
- is_end = Cpnt_8OR( is_end__set_A, bus_state[3], is_simple_reg_to_reg,
                         opcode_is_nop, opcode_is_nop_x,
                         opcode_is_x_arith,
                         BIT_VAL_0,BIT_VAL_0);
- take_interrupt = Cpnt_3AND(is_end, external_interrupt, bus_PS[WiC_PS_FLAG_INDEX_I]);
- trap_state_7 = Cpnt_2AND(bus_state[7], opcode_is_trap);
- is_not_interrupting_end = Cpnt_2AND(is_end, ~take_interrupt);

## Sheet 8 of 11
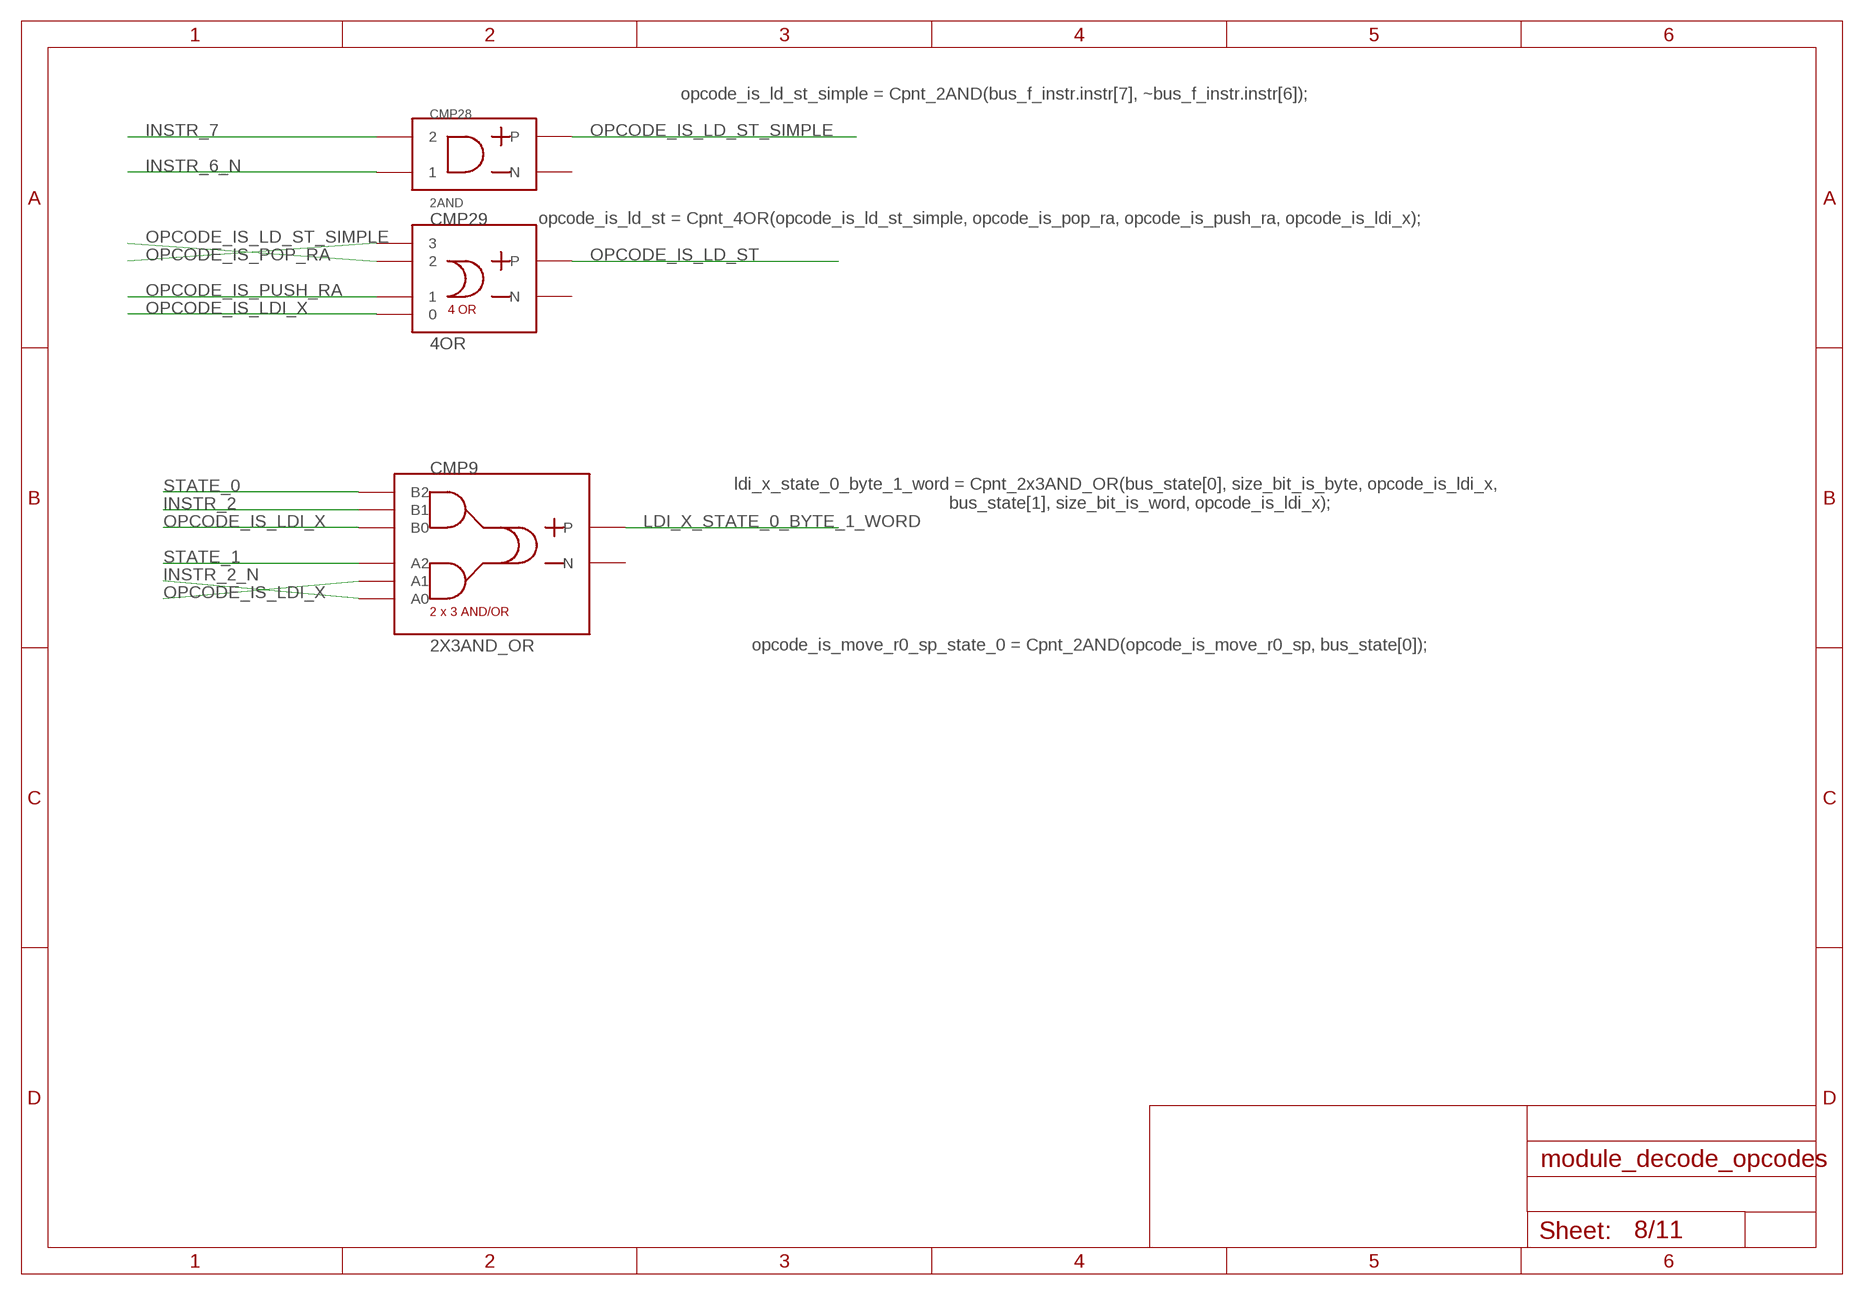
[diagram p7: schematic, sheet 8]

### Parts
CMP9  2X3AND_OR  [2X3AND_OR]
CMP28  2AND  [2AND]
CMP29  4OR  [4OR]

### Nets
INSTR_2: CMP9.P$5(B1) ; also sheet 1,2,3,4
INSTR_2_N: CMP9.P$1(A0) ; also sheet 1
INSTR_6_N: CMP28.P$1 ; also sheet 1
INSTR_7: CMP28.P$2 ; also sheet 1,2,4
LDI_X_STATE_0_BYTE_1_WORD: CMP9.OUT_P(P) ; also sheet 11
OPCODE_IS_LD_ST: CMP29.OUT_P(P) ; also sheet 11
OPCODE_IS_LD_ST_SIMPLE: CMP28.OUT_P(P) CMP29.3
OPCODE_IS_LDI_X: CMP9.P$2(A1) CMP9.P$4(B0) CMP29.1 ; also sheet 4,10
OPCODE_IS_POP_RA: CMP29.4 ; also sheet 4,7,10
OPCODE_IS_PUSH_RA: CMP29.2 ; also sheet 4,7,10
STATE_0: CMP9.P$6(B2) ; also sheet 1
STATE_1: CMP9.P$3(A2) ; also sheet 1
Unconnected: CMP9.OUT_M(N) CMP28.OUT_M(N) CMP29.OUT_M(N)

### Notes on the sheet
- opcode_is_ld_st_simple = Cpnt_2AND(bus_f_instr.instr[7], ~bus_f_instr.instr[6]);
- opcode_is_ld_st = Cpnt_4OR(opcode_is_ld_st_simple, opcode_is_pop_ra, opcode_is_push_ra, opcode_is_ldi_x);
- ldi_x_state_0_byte_1_word = Cpnt_2x3AND_OR(bus_state[0], size_bit_is_byte, opcode_is_ldi_x,
                                                 bus_state[1], size_bit_is_word, opcode_is_ldi_x);
- opcode_is_move_r0_sp_state_0 = Cpnt_2AND(opcode_is_move_r0_sp, bus_state[0]);

## Sheet 9 of 11
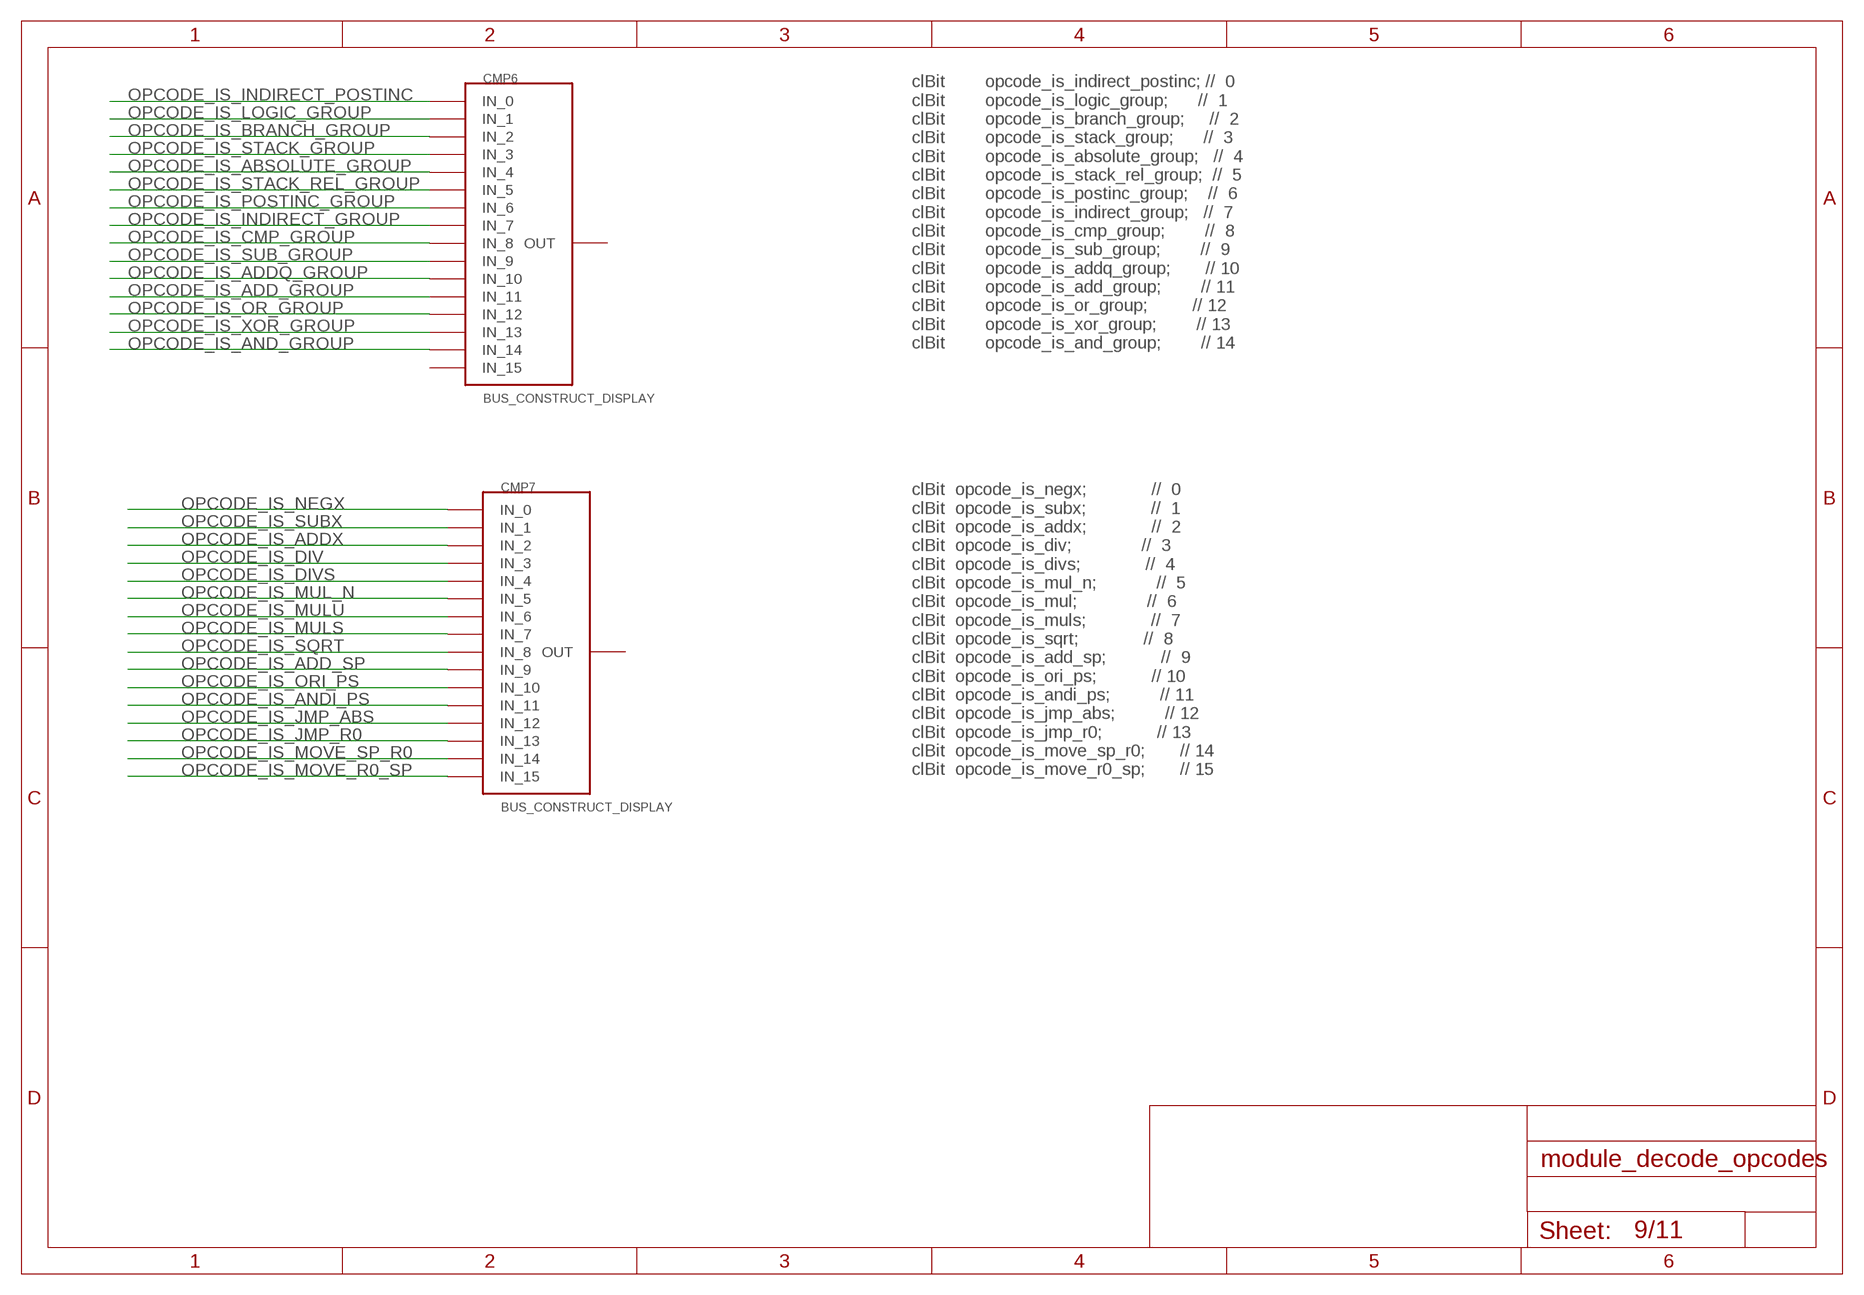
[diagram p8: schematic, sheet 9]

### Parts
CMP6  BUS_CONSTRUCT_DISPLAY  [BUS_SPLIT_DISPLAY]
CMP7  BUS_CONSTRUCT_DISPLAY  [BUS_SPLIT_DISPLAY]

### Nets
OPCODE_IS_ABSOLUTE_GROUP: CMP6.P$5(IN_4) ; also sheet 2
OPCODE_IS_ADD_GROUP: CMP6.P$12(IN_11) ; also sheet 2
OPCODE_IS_ADD_SP: CMP7.P$10(IN_9) ; also sheet 2
OPCODE_IS_ADDQ_GROUP: CMP6.P$11(IN_10) ; also sheet 2
OPCODE_IS_ADDX: CMP7.P$3(IN_2) ; also sheet 2,5
OPCODE_IS_AND_GROUP: CMP6.P$15(IN_14) ; also sheet 2
OPCODE_IS_ANDI_PS: CMP7.P$12(IN_11) ; also sheet 2
OPCODE_IS_BRANCH_GROUP: CMP6.P$3(IN_2) ; also sheet 2
OPCODE_IS_CMP_GROUP: CMP6.P$9(IN_8) ; also sheet 2
OPCODE_IS_DIV: CMP7.P$4(IN_3) ; also sheet 5,6
OPCODE_IS_DIVS: CMP7.P$5(IN_4) ; also sheet 2,5
OPCODE_IS_INDIRECT_GROUP: CMP6.P$8(IN_7) ; also sheet 2,6
OPCODE_IS_INDIRECT_POSTINC: CMP6.P$1(IN_0) ; also sheet 6,7
OPCODE_IS_JMP_ABS: CMP7.P$13(IN_12) ; also sheet 2
OPCODE_IS_JMP_R0: CMP7.P$14(IN_13) ; also sheet 2
OPCODE_IS_LOGIC_GROUP: CMP6.P$2(IN_1) ; also sheet 4
OPCODE_IS_MOVE_R0_SP: CMP7.P$16(IN_15) ; also sheet 2
OPCODE_IS_MOVE_SP_R0: CMP7.P$15(IN_14) ; also sheet 2
OPCODE_IS_MUL_N: CMP7.P$6(IN_5) ; also sheet 5
OPCODE_IS_MULS: CMP7.P$8(IN_7) ; also sheet 2,5
OPCODE_IS_MULU: CMP7.P$7(IN_6) ; also sheet 2,5
OPCODE_IS_NEGX: CMP7.P$1(IN_0) ; also sheet 2,5
OPCODE_IS_OR_GROUP: CMP6.P$13(IN_12) ; also sheet 2
OPCODE_IS_ORI_PS: CMP7.P$11(IN_10) ; also sheet 2
OPCODE_IS_POSTINC_GROUP: CMP6.P$7(IN_6) ; also sheet 2,6
OPCODE_IS_SQRT: CMP7.P$9(IN_8) ; also sheet 2,5
OPCODE_IS_STACK_GROUP: CMP6.P$4(IN_3) ; also sheet 2,3,4
OPCODE_IS_STACK_REL_GROUP: CMP6.P$6(IN_5) ; also sheet 2,7
OPCODE_IS_SUB_GROUP: CMP6.P$10(IN_9) ; also sheet 2
OPCODE_IS_SUBX: CMP7.P$2(IN_1) ; also sheet 2,5
OPCODE_IS_XOR_GROUP: CMP6.P$14(IN_13) ; also sheet 2
Unconnected: CMP6.INPUT(OUT) CMP6.P$16(IN_15) CMP7.INPUT(OUT)

### Notes on the sheet
- clBit        opcode_is_indirect_postinc; //  0
      clBit        opcode_is_logic_group;      //  1
      clBit        opcode_is_branch_group;     //  2
      clBit        opcode_is_stack_group;      //  3
      clBit        opcode_is_absolute_group;   //  4
      clBit        opcode_is_stack_rel_group;  //  5
      clBit        opcode_is_postinc_group;    //  6
      clBit        opcode_is_indirect_group;   //  7
      clBit        opcode_is_cmp_group;        //  8
      clBit        opcode_is_sub_group;        //  9
      clBit        opcode_is_addq_group;       // 10
      clBit        opcode_is_add_group;        // 11
      clBit        opcode_is_or_group;         // 12
      clBit        opcode_is_xor_group;        // 13
      clBit        opcode_is_and_group;        // 14
- clBit  opcode_is_negx;             //  0
      clBit  opcode_is_subx;             //  1
      clBit  opcode_is_addx;             //  2
      clBit  opcode_is_div;              //  3
      clBit  opcode_is_divs;             //  4
      clBit  opcode_is_mul_n;            //  5
      clBit  opcode_is_mul;              //  6
      clBit  opcode_is_muls;             //  7
      clBit  opcode_is_sqrt;             //  8
      clBit  opcode_is_add_sp;           //  9
      clBit  opcode_is_ori_ps;           // 10
      clBit  opcode_is_andi_ps;          // 11
      clBit  opcode_is_jmp_abs;          // 12
      clBit  opcode_is_jmp_r0;           // 13
      clBit  opcode_is_move_sp_r0;       // 14
      clBit  opcode_is_move_r0_sp;       // 15

## Sheet 10 of 11
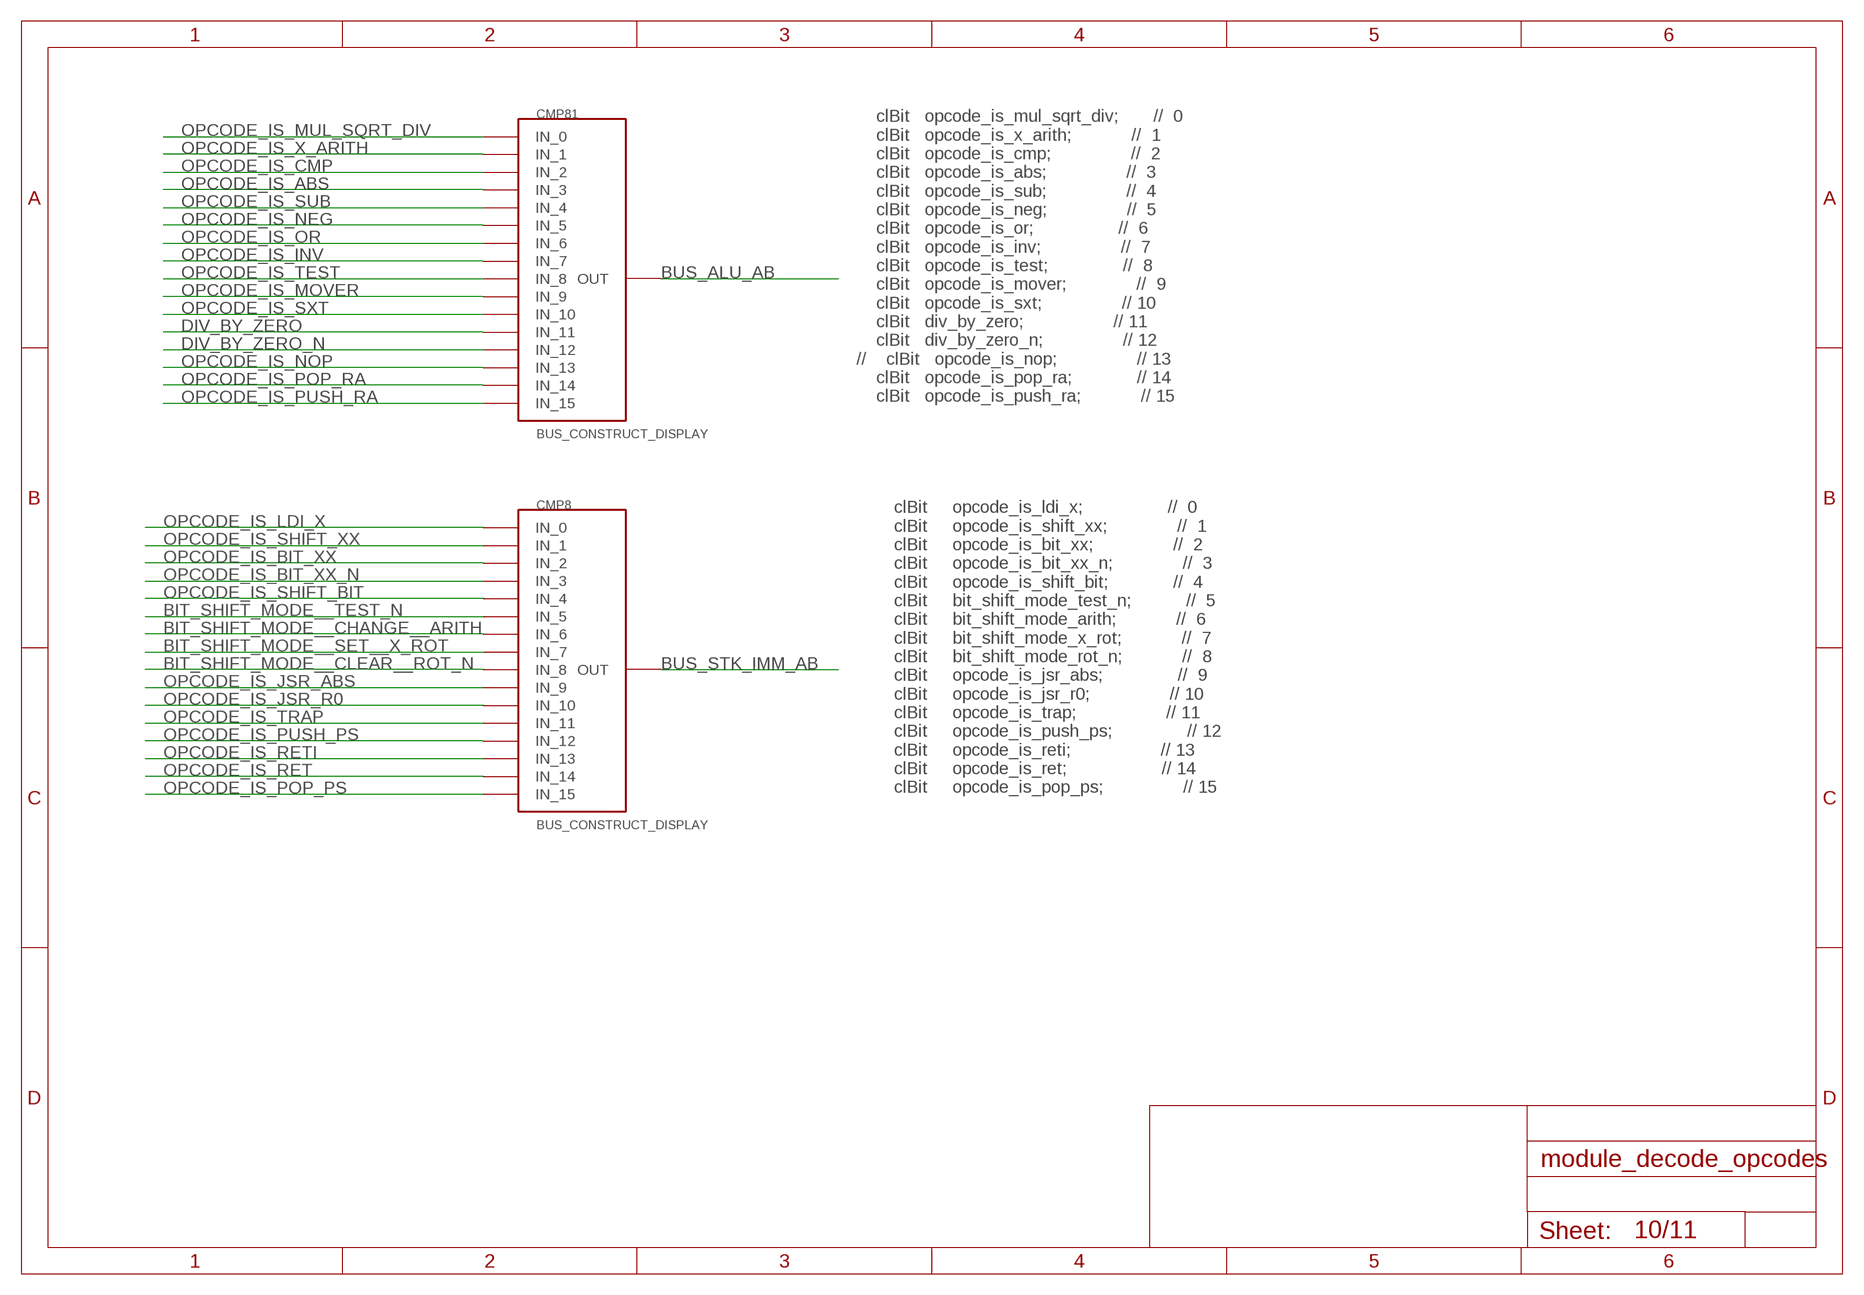
[diagram p9: schematic, sheet 10]

### Parts
CMP8  BUS_CONSTRUCT_DISPLAY  [BUS_SPLIT_DISPLAY]
CMP81  BUS_CONSTRUCT_DISPLAY  [BUS_SPLIT_DISPLAY]

### Nets
BIT_SHIFT_MODE__CHANGE__ARITH: CMP8.P$7(IN_6) ; also sheet 5
BIT_SHIFT_MODE__CLEAR__ROT_N: CMP8.P$9(IN_8) ; also sheet 5
BIT_SHIFT_MODE__SET__X_ROT: CMP8.P$8(IN_7) ; also sheet 5
BIT_SHIFT_MODE__TEST_N: CMP8.P$6(IN_5) ; also sheet 5
BUS_ALU_AB: CMP81.INPUT(OUT)
BUS_STK_IMM_AB: CMP8.INPUT(OUT)
DIV_BY_ZERO: CMP81.P$12(IN_11) ; also sheet 6
DIV_BY_ZERO_N: CMP81.P$13(IN_12) ; also sheet 6
OPCODE_IS_ABS: CMP81.P$4(IN_3) ; also sheet 3
OPCODE_IS_BIT_XX: CMP8.P$3(IN_2) ; also sheet 4
OPCODE_IS_BIT_XX_N: CMP8.P$4(IN_3) ; also sheet 4
OPCODE_IS_CMP: CMP81.P$3(IN_2) ; also sheet 3
OPCODE_IS_INV: CMP81.P$8(IN_7) ; also sheet 3
OPCODE_IS_JSR_ABS: CMP8.P$10(IN_9) ; also sheet 3,5
OPCODE_IS_JSR_R0: CMP8.P$11(IN_10) ; also sheet 3,5
OPCODE_IS_LDI_X: CMP8.P$1(IN_0) ; also sheet 4,8
OPCODE_IS_MOVER: CMP81.P$10(IN_9) ; also sheet 3
OPCODE_IS_MUL_SQRT_DIV: CMP81.P$1(IN_0) ; also sheet 5
OPCODE_IS_NEG: CMP81.P$6(IN_5) ; also sheet 3
OPCODE_IS_NOP: CMP81.P$14(IN_13) ; also sheet 5,7
OPCODE_IS_OR: CMP81.P$7(IN_6) ; also sheet 3
OPCODE_IS_POP_PS: CMP8.P$16(IN_15) ; also sheet 3,7
OPCODE_IS_POP_RA: CMP81.P$15(IN_14) ; also sheet 4,7,8
OPCODE_IS_PUSH_PS: CMP8.P$13(IN_12) ; also sheet 3,7
OPCODE_IS_PUSH_RA: CMP81.P$16(IN_15) ; also sheet 4,7,8
OPCODE_IS_RET: CMP8.P$15(IN_14) ; also sheet 3
OPCODE_IS_RETI: CMP8.P$14(IN_13) ; also sheet 3
OPCODE_IS_SHIFT_BIT: CMP8.P$5(IN_4) ; also sheet 4
OPCODE_IS_SHIFT_XX: CMP8.P$2(IN_1) ; also sheet 4,6
OPCODE_IS_SUB: CMP81.P$5(IN_4) ; also sheet 3
OPCODE_IS_SXT: CMP81.P$11(IN_10) ; also sheet 3
OPCODE_IS_TEST: CMP81.P$9(IN_8) ; also sheet 3
OPCODE_IS_TRAP: CMP8.P$12(IN_11) ; also sheet 3,7
OPCODE_IS_X_ARITH: CMP81.P$2(IN_1) ; also sheet 5,7

### Notes on the sheet
- clBit   opcode_is_mul_sqrt_div;       //  0
      clBit   opcode_is_x_arith;            //  1
      clBit   opcode_is_cmp;                //  2
      clBit   opcode_is_abs;                //  3
      clBit   opcode_is_sub;                //  4
      clBit   opcode_is_neg;                //  5
      clBit   opcode_is_or;                 //  6
      clBit   opcode_is_inv;                //  7
      clBit   opcode_is_test;               //  8
      clBit   opcode_is_mover;              //  9
      clBit   opcode_is_sxt;                // 10
      clBit   div_by_zero;                  // 11
      clBit   div_by_zero_n;                // 12
  //    clBit   opcode_is_nop;                // 13
      clBit   opcode_is_pop_ra;             // 14
      clBit   opcode_is_push_ra;            // 15
- clBit     opcode_is_ldi_x;                 //  0
      clBit     opcode_is_shift_xx;              //  1
      clBit     opcode_is_bit_xx;                //  2
      clBit     opcode_is_bit_xx_n;              //  3
      clBit     opcode_is_shift_bit;             //  4
      clBit     bit_shift_mode_test_n;           //  5
      clBit     bit_shift_mode_arith;            //  6
      clBit     bit_shift_mode_x_rot;            //  7
      clBit     bit_shift_mode_rot_n;            //  8
      clBit     opcode_is_jsr_abs;               //  9
      clBit     opcode_is_jsr_r0;                // 10
      clBit     opcode_is_trap;                  // 11
      clBit     opcode_is_push_ps;               // 12
      clBit     opcode_is_reti;                  // 13
      clBit     opcode_is_ret;                   // 14
      clBit     opcode_is_pop_ps;                // 15

## Sheet 11 of 11
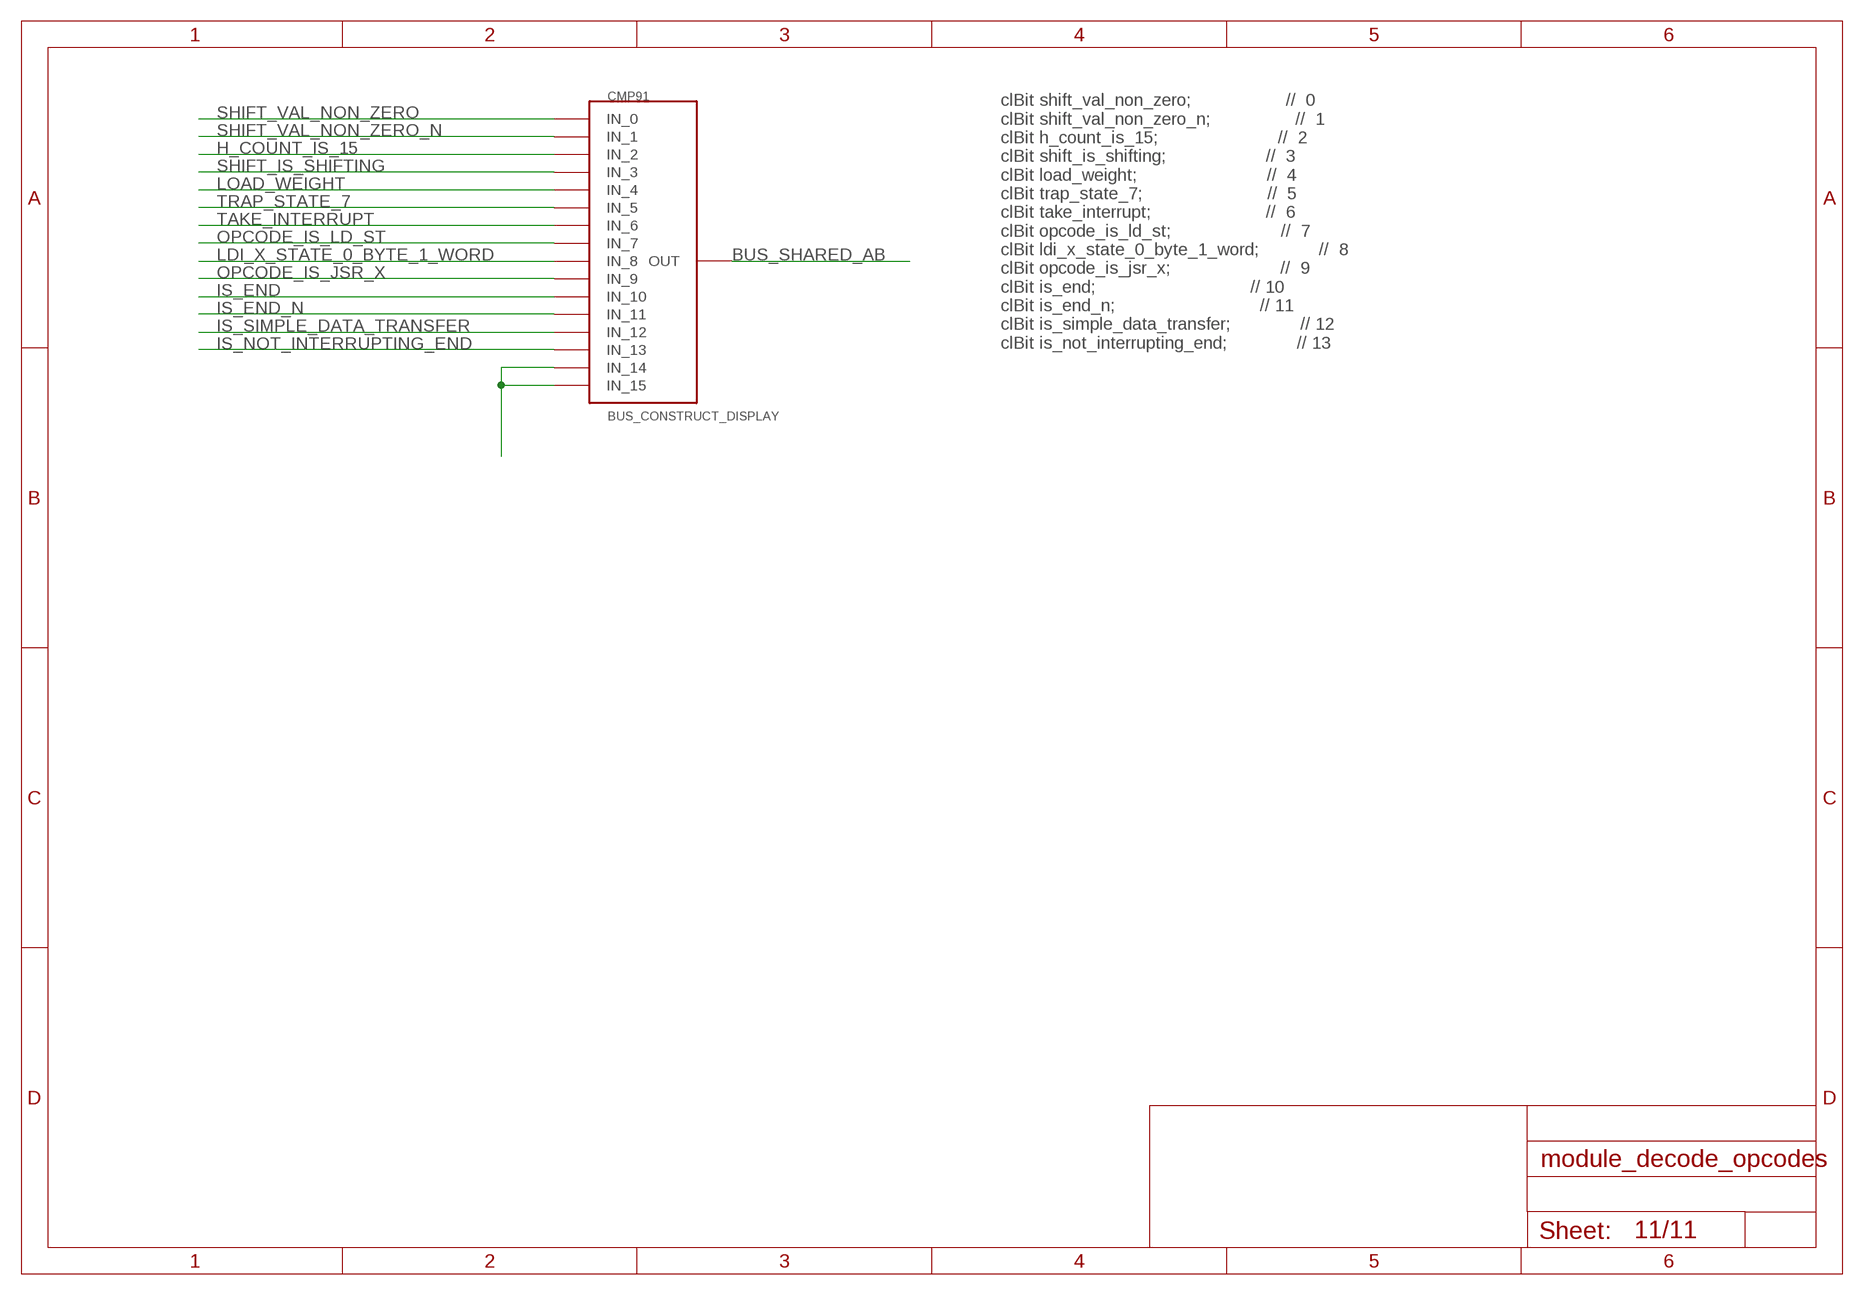
[diagram p10: schematic, sheet 11]

### Parts
CMP91  BUS_CONSTRUCT_DISPLAY  [BUS_SPLIT_DISPLAY]

### Nets
BUS_SHARED_AB: CMP91.INPUT(OUT)
H_COUNT_IS_15: CMP91.P$3(IN_2) ; also sheet 6
IS_END: CMP91.P$11(IN_10) ; also sheet 7
IS_END_N: CMP91.P$12(IN_11) ; also sheet 7
IS_NOT_INTERRUPTING_END: CMP91.P$14(IN_13) ; also sheet 7
IS_SIMPLE_DATA_TRANSFER: CMP91.P$13(IN_12) ; also sheet 7
LDI_X_STATE_0_BYTE_1_WORD: CMP91.P$9(IN_8) ; also sheet 8
LOAD_WEIGHT: CMP91.P$5(IN_4) ; also sheet 6
N$4: CMP91.P$15(IN_14) CMP91.P$16(IN_15)
OPCODE_IS_JSR_X: CMP91.P$10(IN_9) ; also sheet 5
OPCODE_IS_LD_ST: CMP91.P$8(IN_7) ; also sheet 8
SHIFT_IS_SHIFTING: CMP91.P$4(IN_3) ; also sheet 6
SHIFT_VAL_NON_ZERO: CMP91.P$1(IN_0) ; also sheet 6
SHIFT_VAL_NON_ZERO_N: CMP91.P$2(IN_1) ; also sheet 6
TAKE_INTERRUPT: CMP91.P$7(IN_6) ; also sheet 7
TRAP_STATE_7: CMP91.P$6(IN_5) ; also sheet 7

### Notes on the sheet
- clBit shift_val_non_zero;                   //  0
      clBit shift_val_non_zero_n;                 //  1
      clBit h_count_is_15;                        //  2
      clBit shift_is_shifting;                    //  3
      clBit load_weight;                          //  4
      clBit trap_state_7;                         //  5
      clBit take_interrupt;                       //  6
      clBit opcode_is_ld_st;                      //  7
      clBit ldi_x_state_0_byte_1_word;            //  8
      clBit opcode_is_jsr_x;                      //  9
      clBit is_end;                               // 10
      clBit is_end_n;                             // 11
      clBit is_simple_data_transfer;              // 12
      clBit is_not_interrupting_end;              // 13

## Library data of the parts
CMP1 CMP2 = modules:XOR
CMP3 CMP10 CMP27 CMP28 CMP38 CMP69 CMP72 = modules:2AND
CMP4 CMP5 CMP23 CMP25 CMP36 CMP75 CMP76 = modules:2OR
CMP6-CMP8 CMP81 CMP91 = modules:BUS_CONSTRUCT_DISPLAY
CMP9 = modules:2X3AND_OR
CMP12 CMP20 CMP31 = modules:5OR
CMP13-CMP15 CMP17 CMP49 = modules:BUS_SPLIT_DISPLAY
CMP21 CMP22 CMP59 CMP60 = modules:DECODER16
CMP24 CMP39 = modules:3AND
CMP26 = modules:2X2AND_OR
CMP29 = modules:4OR
CMP30 CMP62 = modules:4AND
CMP67 CMP82 CMP94 = modules:DECODER4
CMP74 CMP77 = modules:3OR

## Board
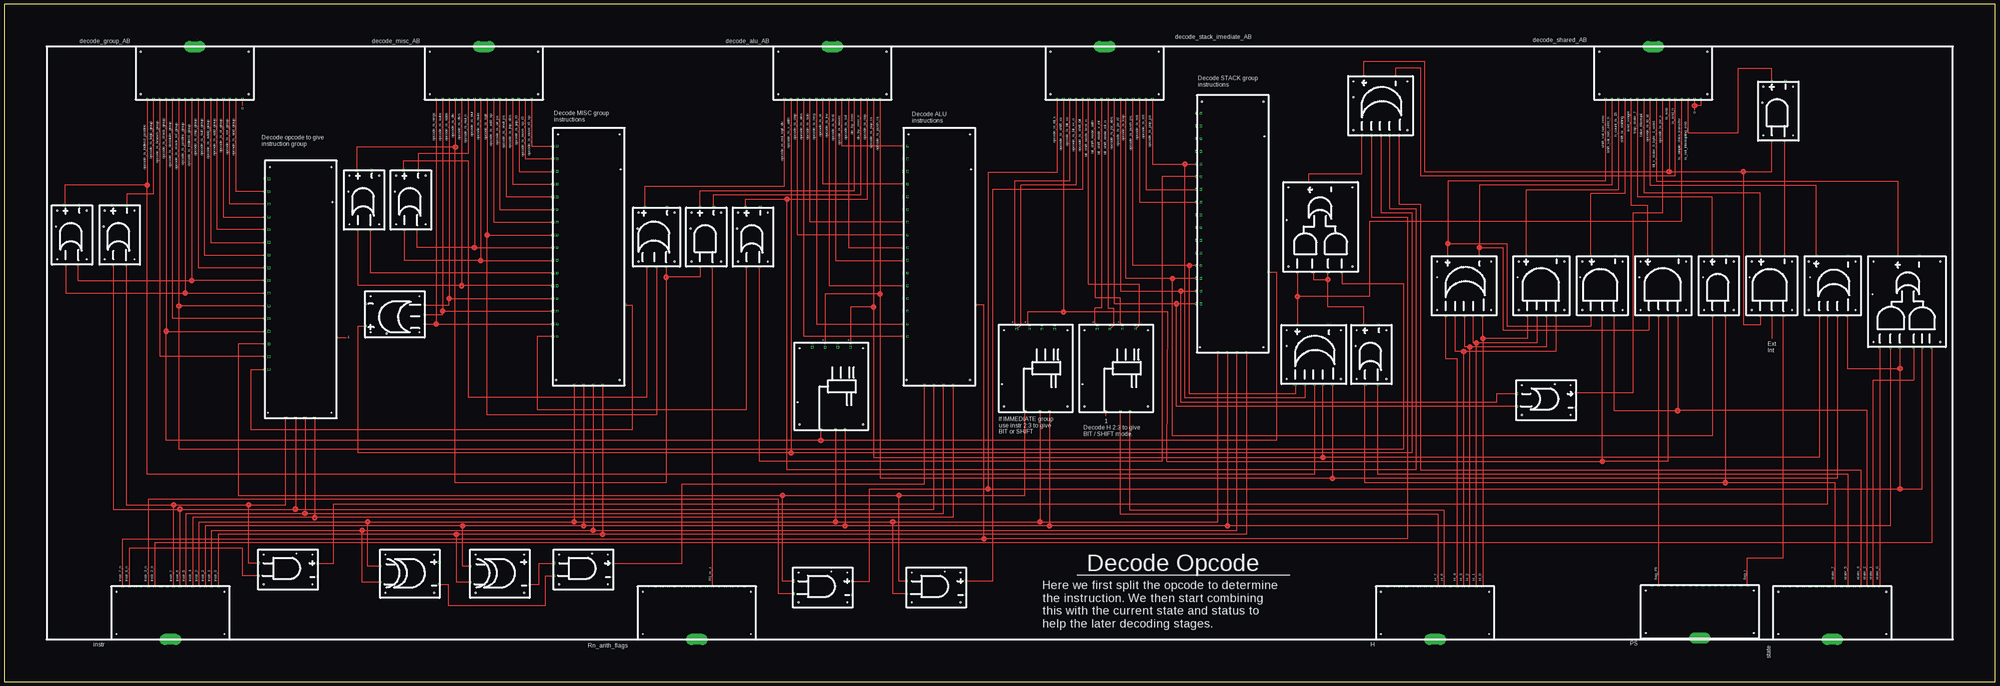
[diagram p11: board, top side]

Size 1193.8 x 406.4 mm. Coordinates in mm from the lower left corner, seen from the top.
Outline: 0,0 1193.8,0 1193.8,406.4 0,406.4 0,0
Copper layers (1*16): Top 0.035mm / dielectric 1.5mm / Bottom 0.035mm
Design rules "default": minimum track width 10mil, minimum drill 24mil, track to track 8mil, track to pad 8mil, pad to pad 8mil, via to via 8mil, smd to smd 8mil, copper to edge 40mil, drill to drill 8mil, minimum pad ring 10mil, minimum via ring 8mil, stop-mask expansion 4mil, vias tented up to drill 0mil, thermal gap 10mil
tKeepout: area 587.8,16.3 to 606,34.5; area 587.8,371.9 to 606,390.1; area 1159.3,371.9 to 1177.5,390.1; area 16.3,371.9 to 34.5,390.1; area 1159.3,16.3 to 1177.5,34.5; area 16.3,16.3 to 34.5,34.5

### Footprints (pad centres in the part's own frame; a part is rotated, then mirrored left to right if it is on the bottom)
XOR = drill 0.8 square: OUT_N 17.78,-6.985; OUT_P 17.78,6.35; P$1 -17.78,-5.715; P$2 -17.78,3.81 | hole 0.6: -14.605,10.795; 14.605,-12.065; 14.605,10.795; -14.605,-12.065
2AND = drill 0.8 square: OUT_M 19.05,-4.445; OUT_P 19.05,3.81; P$1 -16.51,-3.81; P$2 -16.51,3.81 | hole 0.6: -13.335,8.89; 15.875,-8.89; -13.335,-8.89; 15.875,8.89; 6.35,9.525
2OR = drill 0.8 square: OUT_M 17.78,-4.445; OUT_P 17.78,4.445; P$1 -17.78,-3.81; P$2 -17.78,3.81 | hole 0.6: -14.605,8.89; 14.605,-8.89; 14.605,8.89; -14.605,-8.89; 5.08,9.525
BUS_SPLIT_DISPLAY = drill 0.8 pad 6.452 long: INPUT 0,15.24 | drill 0.8 square: P$1 -28.575,-16.51; P$2 -24.765,-16.51; P$3 -20.955,-16.51; P$4 -17.145,-16.51; P$5 -13.335,-16.51; P$6 -9.525,-16.51; P$7 -5.715,-16.51; P$8 -1.905,-16.51; P$9 1.905,-16.51; P$10 5.715,-16.51; P$11 9.525,-16.51; P$12 13.335,-16.51; P$13 17.145,-16.51; P$14 20.955,-16.51; P$15 24.765,-16.51; P$16 28.575,-16.51 | hole 0.6: -32.385,-13.335; -32.385,12.065; 32.385,12.065; 32.385,-13.335
2X3AND_OR = drill 0.8 square: OUT_M 27.94,-6.985; OUT_P 27.94,5.715; P$1 -26.67,-14.605; P$2 -26.67,-8.89; P$3 -26.67,-3.81; P$4 -26.67,4.445; P$5 -26.67,10.16; P$6 -26.67,16.51 | hole 0.6: -23.495,-19.685; 24.765,-19.685; 24.765,20.32; -23.495,20.32; 5.08,20.955
5OR = drill 0.8 square: 1 -17.78,-10.795; 2 -17.78,-5.08; 3 -17.78,0; 4 -17.78,5.715; 5 -17.78,11.43; OUT_M 17.78,-8.89; OUT_P 17.78,10.16 | hole 0.6: -14.605,-15.875; 14.605,-15.875; 14.605,16.51; -14.605,16.51; 5.08,16.51
DECODER16 = drill 0.8 square: A0 -83.82,-8.255; A1 -83.82,-2.54; A2 -83.82,3.175; A3 -83.82,8.89; E -35.56,-21.59; N0 59.69,19.05; N1 52.07,19.05; N2 44.45,19.05; N3 36.83,19.05; N4 29.21,19.05; N5 21.59,19.05; N6 13.97,19.05; N7 6.35,19.05; N8 -1.27,19.05; N9 -8.89,19.05; N10 -16.51,19.05; N11 -24.13,19.05; N12 -31.75,19.05; N13 -39.37,19.05; N14 -46.99,19.05; N15 -54.61,19.05; P0 59.69,21.59; P1 52.07,21.59; P2 44.45,21.59; P3 36.83,21.59; P4 29.21,21.59; P5 21.59,21.59; P6 13.97,21.59; P7 6.35,21.59; P8 -1.27,21.59; P9 -8.89,21.59; P10 -16.51,21.59; P11 -24.13,21.59; P12 -31.75,21.59; P13 -39.37,21.59; P14 -46.99,21.59; P15 -54.61,21.59 | hole 0.6: 66.675,18.415; -80.645,19.685; -80.645,-18.415; 66.675,-18.415; 45.72,-19.05
3AND = drill 0.8 square: OUT_M 16.51,-7.62; OUT_P 16.51,6.985; P$1 -19.05,-6.985; P$2 -19.05,0; P$3 -19.05,6.985 | hole 0.6: -15.875,-12.065; 13.335,-12.065; 13.335,12.065; -15.875,12.065; 3.81,13.335
2X2AND_OR = drill 0.8 square: OUT_M 27.94,-6.985; OUT_P 27.94,6.35; P$1 -26.035,-13.335; P$2 -26.035,-5.08; P$3 -26.035,3.81; P$4 -26.035,13.335 | hole 0.6: -22.86,18.733; 24.765,18.733; -22.86,-19.685; 24.765,-19.685; 5.08,19.685
4OR = drill 0.8 square: 1 -16.51,-8.255; 2 -16.51,-2.54; 3 -16.51,3.175; 4 -16.51,8.255; OUT_M 19.05,-8.89; OUT_P 19.05,10.16 | hole 0.6: -13.335,-13.335; 15.875,-13.335; 15.875,14.605; -13.335,14.605; 6.35,13.97
4AND = drill 0.8 square: OUT_M 17.145,-8.89; OUT_P 17.145,9.525; P$1 -18.415,-8.255; P$2 -18.415,-2.54; P$3 -18.415,3.175; P$4 -18.415,8.89 | hole 0.6: -15.24,-13.335; 13.97,-13.335; 13.97,13.97; -15.24,13.97; 4.445,14.605
DECODER4 = drill 0.8 square: A0 -24.765,-7.62; A1 -24.765,-1.905; E -24.765,6.985; N0 24.765,-10.795; N1 24.765,-3.175; N2 24.765,4.445; N3 24.765,12.065; P0 27.305,-10.795; P1 27.305,-3.175; P2 27.305,4.445; P3 27.305,12.065 | hole 0.6: 24.13,19.685; -21.59,19.685; -21.59,-18.415; 24.13,-18.415; -8.255,20.955
3OR = drill 0.8 square: OUT_M 16.51,-6.985; OUT_P 16.51,6.35; P$1 -19.05,-6.35; P$2 -19.05,-0.635; P$3 -19.05,5.08 | hole 0.6: -15.875,-11.43; 13.335,-11.43; 13.335,10.16; -15.875,10.16; 3.81,10.795

### Placement (x,y rotation side)
CMP1  297.18,65.41 0 top
CMP2  243.21,65.41 0 top
CMP3  346.07,67.31 0 top
CMP4  448.94,266.7 90 top
CMP5  924.56,168.91 0 top
CMP6  114.3,365.76 0 top
CMP7  287.65,365.76 0 top
CMP8  659.76,365.76 0 top
CMP9  1141.1,227.33 90 top
CMP10  1063.62,341 90 top
CMP12  785.5,196.22 90 top
CMP13  1096.01,40.64 180 top
CMP14  857.88,40.64 180 top
CMP15  99.69,40.64 180 top
CMP17  1016.63,41.27 180 top
CMP20  875.66,237.49 90 top
CMP21  177.8,241.94 90 top
CMP22  350.52,261.62 90 top
CMP23  69.22,267.97 90 top
CMP24  958.22,238.76 90 top
CMP25  819.78,196.22 90 top
CMP26  788.67,271.78 90 top
CMP27  1028.07,236.22 90 top
CMP28  168.91,67.31 0 top
CMP29  1096.64,236.22 90 top
CMP30  922.02,238.12 90 top
CMP31  825.5,345.44 90 top
CMP36  40.64,267.97 90 top
CMP38  421,265.43 90 top
CMP39  1059.82,238.76 90 top
CMP49  415.29,40.64 180 top
CMP59  736.6,281.31 90 top
CMP60  560.71,261.62 90 top
CMP62  995.04,238.12 90 top
CMP67  619.12,186.69 90 top
CMP69  489.58,56.52 0 top
CMP72  557.53,56.52 0 top
CMP74  233.04,219.71 180 top
CMP75  243.84,288.93 90 top
CMP76  215.9,288.93 90 top
CMP77  390.52,267.97 90 top
CMP81  496.57,365.76 0 top
CMP82  667.38,186.69 90 top
CMP91  988.7,365.76 0 top
CMP94  496.57,175.9 90 top

### Tracks (layer width: path | path; a pad name or v marks a point on that pad's centre or on a via)
BIT_SHIFT_MODE__CHANGE__ARITH
  Top 0.61: CMP8.P$7 654.05,230.5 669.29,230.5 669.29,215.26 CMP82.P1
BIT_SHIFT_MODE__CLEAR__ROT_N
  Top 0.61: CMP8.P$9 661.67,224.16 665.48,224.16 665.48,214 CMP82.N2
BIT_SHIFT_MODE__SET__X_ROT
  Top 0.61: CMP8.P$8 657.86,224.16 654.05,224.16 654.05,215.26 CMP82.P3
BIT_SHIFT_MODE__TEST_N
  Top 0.61: CMP8.P$6 650.24,238.12 680.72,238.12 680.72,214 CMP82.N0
DIV_BY_ZERO
  Top 0.61: CMP38.OUT_P 417.19,294.64 509.9,294.64 CMP81.P$12
DIV_BY_ZERO_N
  Top 0.61: CMP38.OUT_M 425.45,292.1 513.72,292.1 CMP81.P$13
END_OF_DATA_TRANSFER
  Top 0.61: CMP26.P$3 784.86,241.3 793.75,241.3 | 793.75,241.3 CMP26.P$2 | CMP25.OUT_P 815.34,224.79 793.75,224.79 793.75,241.3
FLAG_F6
  Top 0.61: CMP62.P$3 CMP17.P$15
FLAG_I
  Top 0.61: CMP17.P$1 1045.21,74.3 1066.8,74.3 CMP39.P$1
H_0
  Top 0.61: CMP30.P$4 913.13,205.74 886.46,205.74 | 886.46,205.74 CMP20.1 | 886.46,205.74 CMP14.P$1
H_1
  Top 0.61: CMP30.P$3 918.85,203.2 882.65,203.2 | 882.65,203.2 880.75,203.2 CMP20.2 | CMP14.P$2 882.65,203.2
H_2
  Top 0.61: CMP30.P$2 924.56,200.66 878.84,200.66 | 878.84,200.66 875.66,200.66 CMP20.3 | CMP14.P$3 878.84,200.66
H_3
  Top 0.61: CMP30.P$1 930.27,198.12 875.03,198.12 | 875.03,198.12 869.95,198.12 CMP20.4 | CMP14.P$4 875.03,198.12
H_4
  Top 0.61: CMP14.P$5 871.22,193.68 864.24,193.68 CMP20.5
H_6
  Top 0.61: CMP14.P$7 863.6,102.87 675,102.87 CMP82.A0
H_7
  Top 0.61: CMP14.P$8 859.79,100.33 669.29,100.33 CMP82.A1
H_COUNT_IS_15
  Top 0.61: CMP91.P$3 967.74,295.27 912.5,295.27 CMP30.OUT_P
INSTR_0
  Top 0.61: CMP59.A0 744.86,88.27 358.77,88.27 | 358.77,88.27 271.14,88.27 | 271.14,88.27 128.27,88.27 CMP15.P$1 | CMP22.A0 358.77,88.27 | CMP1.P$1 271.14,59.69 271.14,88.27
INSTR_1
  Top 0.61: CMP15.P$2 124.46,90.81 214.63,90.81 | 214.63,90.81 353.06,90.81 | 353.06,90.81 739.14,90.81 CMP59.A1 | CMP22.A1 353.06,90.81 | CMP2.P$1 214.63,59.69 214.63,90.81
INSTR_2
  Top 0.61: CMP59.A2 733.42,93.34 | 733.42,93.34 626.75,93.34 | 626.75,93.34 504.19,93.34 | 504.19,93.34 347.35,93.34 | 347.35,93.34 274.95,93.34 | 274.95,93.34 120.65,93.34 CMP15.P$3 | CMP22.A2 347.35,93.34 | CMP67.A0 626.75,93.34 | CMP94.A0 504.19,93.34 | CMP9.P$5 1130.93,93.34 733.42,93.34 | CMP1.P$2 274.95,69.22 274.95,93.34
INSTR_2_N
  Top 0.61: CMP9.P$1 1155.7,83.19 90.17,83.19 CMP15.P$11
INSTR_3
  Top 0.61: CMP15.P$4 116.84,95.89 217.81,95.89 | 217.81,95.89 341.63,95.89 | 341.63,95.89 498.48,95.89 | 498.48,95.89 532.76,95.89 | 532.76,95.89 621.03,95.89 | 621.03,95.89 727.71,95.89 CMP59.A3 | CMP22.A3 341.63,95.89 | CMP94.A1 498.48,95.89 | CMP67.A1 621.03,95.89 | CMP2.P$2 217.81,69.22 217.81,95.89 | CMP72.P$1 532.76,52.7 532.76,95.89
INSTR_3_N
  Top 0.61: CMP69.P$1 464.19,52.7 464.19,109.22 86.36,109.22 CMP15.P$12
INSTR_4
  Top 0.61: CMP60.A0 568.96,98.42 186.06,98.42 | 186.06,98.42 113.03,98.42 CMP15.P$5 | CMP21.A0 186.06,98.42
INSTR_5
  Top 0.61: CMP15.P$6 109.22,100.97 180.34,100.97 | 180.34,100.97 563.25,100.97 CMP60.A1 | CMP21.A1 180.34,100.97
INSTR_6
  Top 0.61: CMP15.P$7 105.41,103.5 | 105.41,103.5 174.62,103.5 | 174.62,103.5 557.53,103.5 CMP60.A2 | CMP23.P$2 65.41,103.5 105.41,103.5 | CMP21.A2 174.62,103.5
INSTR_6_N
  Top 0.61: CMP28.P$1 142.88,63.5 142.88,80.01 74.93,80.01 CMP15.P$15
INSTR_7
  Top 0.61: CMP15.P$8 101.6,106.05 | 101.6,106.05 146.69,106.05 | 146.69,106.05 168.91,106.05 CMP21.A3 | CMP23.P$1 73.03,106.05 101.6,106.05 | CMP28.P$2 146.69,71.12 146.69,106.05
INSTR_7_N
  Top 0.61: CMP15.P$16 71.12,85.72 587.38,85.72 | 587.38,85.72 587.38,226.06 CMP60.E | CMP31.4 819.78,278.76 841.38,278.76 841.38,85.72 587.38,85.72
IS_END
  Top 0.61: CMP31.OUT_P 815.34,372.11 851.53,372.11 851.53,306.07 998.22,306.07 | CMP39.P$3 1052.83,214 1042.67,214 1042.67,306.07 | CMP91.P$11 998.22,306.07 | 998.22,306.07 1042.67,306.07 | 1042.67,306.07 1059.82,306.07 CMP10.P$2
IS_END__SET_A
  Top 0.61: CMP26.OUT_P 782.32,304.8 814.07,304.8 CMP31.5
IS_END_N
  Top 0.61: CMP31.OUT_M 834.39,368.3 849,368.3 849,303.53 1002.03,303.53 CMP91.P$12
IS_NOT_INTERRUPTING_END
  Top 0.61: CMP10.OUT_P 1059.82,367.67 1039.49,367.67 1039.49,328.93 1009.65,328.93 CMP91.P$14
IS_SIMPLE_DATA_TRANSFER
  Top 0.61: CMP26.P$4 775.34,231.14 | 775.34,231.14 CMP12.OUT_P | 775.34,231.14 818.51,231.14 818.51,276.23 1005.84,276.23 CMP91.P$13
LDI_X_STATE_0_BYTE_1_WORD
  Top 0.61: CMP91.P$9 990.6,300.36 1135.38,300.36 CMP9.OUT_P
LOAD_WEIGHT
  Top 0.61: CMP91.P$5 975.36,285.75 985.52,285.75 CMP62.OUT_P
N$1
  Top 0.61: 1059.82,218.44 1059.82,205.74
N$2
  Top 0.61: 660.4,161.93 660.4,159.38
N$3
  Top 0.61: 200.03,206.38 205.1,206.38
N$4
  Top 0.61: 1013.46,345.44 1013.46,342.9 | CMP91.P$16 1017.27,345.44 1013.46,345.44 | CMP91.P$15 1013.46,345.44
N$5
  Top 0.61: 142.88,345.44 142.88,347.98
N$6
  Top 0.61: CMP1.OUT_N 320.68,58.42 320.68,71.12 CMP3.P$2
N$7
  Top 0.61: CMP2.OUT_N 266.06,58.42 266.06,45.72 324.49,45.72 324.49,63.5 CMP3.P$1
OPCODE_IS_ABS
  Top 0.61: CMP60.P15 479.43,207.01 CMP81.P$4
OPCODE_IS_ABSOLUTE_GROUP
  Top 0.61: CMP21.P11 100.97,217.81 CMP6.P$5
OPCODE_IS_ADD_GROUP
  Top 0.61: CMP21.P4 127.64,271.14 CMP6.P$12
OPCODE_IS_ADD_SP
  Top 0.61: CMP7.P$10 293.37,275.59 CMP22.P6
OPCODE_IS_ADDQ_GROUP
  Top 0.61: CMP6.P$11 123.83,263.52 CMP21.P5
OPCODE_IS_ADDX
  Top 0.61: CMP7.P$3 266.7,229.87 | 266.7,229.87 CMP22.P12 | CMP74.P$1 266.7,226.06 266.7,229.87
OPCODE_IS_AND_GROUP
  Top 0.61: CMP21.P1 139.06,294 CMP6.P$15
OPCODE_IS_ANDI_PS
  Top 0.61: CMP7.P$12 300.99,290.83 CMP22.P4
OPCODE_IS_BIT_XX
  Top 0.61: CMP8.P$3 638.81,300.36 605.79,300.36 605.79,215.26 CMP67.P3
OPCODE_IS_BIT_XX_N
  Top 0.61: CMP8.P$4 642.62,297.81 609.6,297.81 609.6,214 CMP67.N3
OPCODE_IS_BRANCH_GROUP
  Top 0.61: CMP6.P$3 93.34,194.94 CMP21.P14
OPCODE_IS_CMP
  Top 0.61: CMP60.P7 475.62,267.97 CMP81.P$3
OPCODE_IS_CMP_GROUP
  Top 0.61: CMP6.P$9 116.2,248.28 CMP21.P7
OPCODE_IS_DIV
  Top 0.61: CMP7.P$4 270.51,320.68 | 270.51,320.68 211.46,320.68 CMP76.OUT_P | CMP77.P$1 396.88,242.57 | 396.88,242.57 396.88,119.38 270.51,119.38 270.51,320.68 | CMP38.P$2 417.19,242.57 396.88,242.57
OPCODE_IS_DIVS
  Top 0.61: CMP22.P11 274.32,237.49 | 274.32,237.49 212.09,237.49 CMP76.P$2 | CMP7.P$5 274.32,237.49
OPCODE_IS_DIVU
  Top 0.61: CMP22.P10 219.71,245.11 CMP76.P$1
OPCODE_IS_IMMEDIATE_GROUP
  Top 0.61: CMP21.P13 140.34,202.56 140.34,111.76 466.73,111.76 | 466.73,111.76 536.58,111.76 | 536.58,111.76 612.14,111.76 CMP67.E | CMP72.P$2 536.58,60.33 536.58,111.76 | CMP69.P$2 466.73,60.33 466.73,111.76
OPCODE_IS_INDIRECT_GROUP
  Top 0.61: CMP21.P8 112.39,240.66 | CMP36.P$1 44.45,240.66 112.39,240.66 | CMP6.P$8 112.39,240.66
OPCODE_IS_INDIRECT_POSTINC
  Top 0.61: CMP6.P$1 85.72,297.81 | 85.72,297.81 36.2,297.81 CMP36.OUT_P | CMP12.3 785.5,124.46 85.72,124.46 85.72,297.81
OPCODE_IS_INV
  Top 0.61: CMP81.P$8 494.67,237.49 CMP60.P11
OPCODE_IS_JMP_ABS
  Top 0.61: CMP7.P$13 304.8,298.45 CMP22.P3
OPCODE_IS_JMP_R0
  Top 0.61: CMP7.P$14 308.61,306.07 CMP22.P2
OPCODE_IS_JSR_ABS
  Top 0.61: CMP5.P$1 702.95,165.1 702.95,226.69 | CMP8.P$10 665.48,226.69 702.95,226.69 | 702.95,226.69 CMP59.P15
OPCODE_IS_JSR_R0
  Top 0.61: CMP5.P$2 894.72,172.72 894.72,167.64 705.49,167.64 705.49,234.31 | CMP8.P$11 669.29,234.31 705.49,234.31 | 705.49,234.31 CMP59.P14
OPCODE_IS_JSR_X
  Top 0.61: CMP5.OUT_P 976.63,173.35 976.63,281.31 994.41,281.31 CMP91.P$10
OPCODE_IS_LD_ST
  Top 0.61: CMP91.P$8 986.79,297.81 1086.48,297.81 CMP29.OUT_P
OPCODE_IS_LD_ST_SIMPLE
  Top 0.61: CMP28.OUT_P 197.49,71.12 197.49,106.68 1093.47,106.68 CMP29.3
OPCODE_IS_LDI_X
  Top 0.61: 589.91,115.57 1136.65,115.57 | 1136.65,115.57 1149.98,115.57 CMP9.P$2 | CMP9.P$4 1136.65,187.96 | 1136.65,187.96 1136.65,115.57 | CMP8.P$1 631.19,305.44 589.91,305.44 589.91,115.57 | CMP69.OUT_P 518.79,60.33 518.79,115.57 589.91,115.57 | CMP29.1 1104.9,187.96 1136.65,187.96
OPCODE_IS_LOGIC_GROUP
  Top 0.61: CMP23.OUT_M 73.66,292.74 89.53,292.74 CMP6.P$2
OPCODE_IS_MISC_GROUP
  Top 0.61: CMP22.E 376.56,226.06 376.56,151.13 147.96,151.13 147.96,187.32 CMP21.P15
OPCODE_IS_MOVE_R0_SP
  Top 0.61: CMP7.P$16 316.23,321.31 CMP22.P0
OPCODE_IS_MOVE_SP_R0
  Top 0.61: CMP7.P$15 312.42,313.69 CMP22.P1
OPCODE_IS_MOVER
  Top 0.61: CMP60.P0 502.29,321.31 CMP81.P$10
OPCODE_IS_MUL
  Top 0.61: CMP75.OUT_P 239.4,312.42 278.13,312.42 278.13,170.81 385.44,170.81 CMP77.P$3
OPCODE_IS_MUL_N
  Top 0.61: CMP7.P$6 278.13,316.87 248.28,316.87 CMP75.OUT_M
OPCODE_IS_MUL_SQRT_DIV
  Top 0.61: CMP77.OUT_P 384.18,297.18 468,297.18 CMP81.P$1
OPCODE_IS_MULS
  Top 0.61: CMP7.P$8 285.75,252.73 | 285.75,252.73 CMP22.P9 | 285.75,252.73 240.03,252.73 CMP75.P$2
OPCODE_IS_MULU
  Top 0.61: CMP7.P$7 281.94,260.35 | 281.94,260.35 CMP22.P8 | 281.94,260.35 247.65,260.35 CMP75.P$1
OPCODE_IS_NEG
  Top 0.61: CMP81.P$6 487.05,214.63 CMP60.P14
OPCODE_IS_NEGX
  Top 0.61: CMP7.P$1 259.08,214.63 | 259.08,214.63 CMP22.P14 | CMP74.P$3 259.08,214.63
OPCODE_IS_NOP
  Top 0.61: CMP4.OUT_P 444.5,289.56 469.26,289.56 | 469.26,289.56 517.52,289.56 CMP81.P$14 | CMP31.2 830.58,283.85 846.46,283.85 846.46,127 469.26,127 469.26,289.56
OPCODE_IS_NOP_1
  Top 0.61: CMP22.P15 319.4,207.01 319.4,163.19 445.13,163.19 CMP4.P$2
OPCODE_IS_NOP_2
  Top 0.61: CMP59.P5 694.05,302.89 694.05,132.08 452.75,132.08 CMP4.P$1
OPCODE_IS_OR
  Top 0.61: CMP60.P3 490.86,298.45 CMP81.P$7
OPCODE_IS_OR_GROUP
  Top 0.61: CMP6.P$13 131.44,278.76 CMP21.P3
OPCODE_IS_ORI_PS
  Top 0.61: CMP7.P$11 297.18,283.21 CMP22.P5
OPCODE_IS_POP_PS
  Top 0.61: CMP8.P$16 688.34,310.51 708.02,310.51 | 708.02,310.51 CMP59.P4 | CMP12.4 779.78,170.18 708.02,170.18 708.02,310.51
OPCODE_IS_POP_RA
  Top 0.61: CMP81.P$15 521.34,224.79 | 521.34,224.79 507.37,224.79 CMP94.P0 | 521.34,224.79 521.34,134.62 790.58,134.62 | 790.58,134.62 CMP12.2 | CMP29.4 1088.39,134.62 790.58,134.62
OPCODE_IS_POSTINC_GROUP
  Top 0.61: CMP6.P$7 108.58,233.04 | 108.58,233.04 CMP21.P9 | CMP36.P$2 36.83,233.04 108.58,233.04
OPCODE_IS_PUSH_PS
  Top 0.61: CMP59.P12 710.57,249.56 | 710.57,249.56 676.91,249.56 CMP8.P$13 | CMP12.5 774.07,172.72 710.57,172.72 710.57,249.56
OPCODE_IS_PUSH_RA
  Top 0.61: CMP81.P$16 525.14,232.41 | 525.14,232.41 492.12,232.41 CMP94.P2 | 525.14,232.41 525.14,121.92 796.29,121.92 | CMP29.2 1099.18,121.92 796.29,121.92 | CMP12.1 796.29,121.92
OPCODE_IS_RET
  Top 0.61: CMP8.P$15 684.53,295.27 CMP59.P6
OPCODE_IS_RETI
  Top 0.61: CMP8.P$14 680.72,287.65 CMP59.P7
OPCODE_IS_SHIFT_BIT
  Top 0.61: CMP8.P$5 646.43,295.27 592.46,295.27 592.46,60.33 CMP72.OUT_P
OPCODE_IS_SHIFT_XX
  Top 0.61: 958.22,132.08 697.23,132.08 697.87,221.62 635,221.62 | 958.22,132.08 CMP24.P$2 | CMP62.P$2 997.59,132.08 958.22,132.08 | CMP8.P$2 635,221.62 | 635,221.62 613.41,221.62 613.41,215.26 CMP67.P2
OPCODE_IS_SQRT
  Top 0.61: CMP7.P$9 289.56,267.97 | 289.56,267.97 CMP22.P7 | CMP77.P$2 391.16,160.02 289.56,160.02 289.56,267.97
OPCODE_IS_STACK_GROUP
  Top 0.61: CMP6.P$4 97.16,210.19 | 97.16,210.19 CMP21.P12 | CMP94.E 489.58,144.78 | 489.58,144.78 97.16,144.78 97.16,210.19 | CMP59.E 762.63,245.75 762.63,144.78 489.58,144.78
OPCODE_IS_STACK_REL_GROUP
  Top 0.61: CMP6.P$6 104.78,225.43 | 104.78,225.43 104.78,139.7 838.84,139.7 838.84,238.76 802,238.76 CMP26.P$1 | CMP21.P10 104.78,225.43
OPCODE_IS_SUB
  Top 0.61: CMP60.P6 483.24,275.59 CMP81.P$5
OPCODE_IS_SUB_GROUP
  Top 0.61: CMP6.P$10 120.02,255.91 CMP21.P6
OPCODE_IS_SUBX
  Top 0.61: CMP7.P$2 262.89,222.25 | 262.89,222.25 CMP22.P13 | CMP74.P$2 262.89,220.34 262.89,222.25
OPCODE_IS_SXT
  Top 0.61: CMP81.P$11 506.1,260.35 CMP60.P8
OPCODE_IS_TEST
  Top 0.61: CMP81.P$9 498.48,252.73 CMP60.P9
OPCODE_IS_TRAP
  Top 0.61: CMP59.P13 700.4,241.94 | 700.4,241.94 672.47,241.94 672.47,348.62 CMP8.P$12 | CMP27.P$2 1024.26,147.32 700.4,147.32 700.4,241.94
OPCODE_IS_X_ARITH
  Top 0.61: CMP81.P$2 471.81,137.16 | 471.81,137.16 212.09,137.16 212.09,213.36 CMP74.OUT_P | CMP31.3 825.5,281.31 843.91,281.31 843.91,137.16 471.81,137.16
OPCODE_IS_XOR_GROUP
  Top 0.61: CMP21.P2 135.25,286.38 CMP6.P$14
R1_IS_Z
  Top 0.61: CMP49.P$6 CMP38.P$1
RA_EQUALS_RB
  Top 0.61: CMP3.OUT_P 406.4,71.12 406.4,118.75 551.82,118.75 CMP60.A3
SHIFT_IS_SHIFTING
  Top 0.61: CMP91.P$4 971.55,292.74 951.23,292.74 CMP24.OUT_P
SHIFT_VAL_NON_ZERO
  Top 0.61: CMP20.OUT_P 865.5,262.89 | 865.5,262.89 901.07,262.89 901.07,213.36 951.23,213.36 CMP24.P$3 | CMP91.P$1 960.12,300.36 865.5,300.36 865.5,262.89
SHIFT_VAL_NON_ZERO_N
  Top 0.61: CMP20.OUT_M 884.55,260.35 | 884.55,260.35 898.52,260.35 898.52,210.82 986.15,210.82 CMP62.P$4 | CMP91.P$2 963.93,297.81 884.55,297.81 884.55,260.35
STATE_0
  Top 0.61: CMP9.P$6 CMP13.P$1
STATE_1
  Top 0.61: CMP9.P$3 1144.9,180.97 1120.78,180.97 CMP13.P$2
STATE_2
  Top 0.61: CMP62.P$1 1003.3,162.56 | CMP24.P$1 965.2,162.56 1003.3,162.56 | CMP13.P$3 1116.96,162.56 1003.3,162.56
STATE_3
  Top 0.61: CMP31.1 836.29,286.38 849,286.38 849,127 1113.15,127 CMP13.P$4
STATE_5
  Top 0.61: CMP25.P$1 823.6,124.46 1105.54,124.46 CMP13.P$6
STATE_7
  Top 0.61: CMP27.P$1 1031.88,119.38 | 1031.88,119.38 815.98,119.38 CMP25.P$2 | CMP13.P$8 1097.91,119.38 1031.88,119.38
TAKE_INTERRUPT
  Top 0.61: CMP91.P$7 982.98,293.37 1052.83,293.37 CMP39.OUT_P
TAKE_INTERRUPT_N
  Top 0.61: CMP39.OUT_M CMP10.P$1
TRAP_STATE_7
  Top 0.61: CMP91.P$6 979.17,290.83 1024.26,290.83 CMP27.OUT_P
(copper drawn outside any net)
  shapes: Top circle x67

### Text on the board
tPlace: decode_stack_imediate_AB | decode_shared_AB | decode_group_AB | decode_misc_AB | decode_alu_AB | Decode STACK group / instructions | 0 | 0 | is_end | Decode MISC group / instructions | Decode ALU / instructions | is_end_n | load_weight | trap_state_7 | div_by_zero | opcode_is_mul | opcode_is_or | h_count_is_15 | take_interrupt | opcode_is_div | opcode_is_inv | opcode_is_ret | opcode_is_divs | opcode_is_muls | opcode_is_sqrt | opcode_is_cmp | opcode_is_abs | opcode_is_sub | opcode_is_neg | opcode_is_sxt | div_by_zero_n | opcode_is_nop | opcode_is_reti | opcode_is_negx | opcode_is_subx | opcode_is_addx | opcode_is_test | opcode_is_trap | opcode_is_ld_st | opcode_is_mul_n | opcode_is_ldi_x | shift_is_shifting | opcode_is_jsr_x | opcode_is_ori_ps | opcode_is_jmp_r0 | opcode_is_mover | Decode opcode to give / instruction group | opcode_is_add_sp | opcode_is_bit_xx | opcode_is_jsr_r0 | opcode_is_pop_ps | opcode_is_andi_ps | opcode_is_jmp_abs | opcode_is_x_arith | opcode_is_pop_ra | shift_val_non_zero | opcode_is_push_ra | opcode_is_shift_xx | opcode_is_jsr_abs | opcode_is_push_ps | opcode_is_or_group | opcode_is_bit_xx_n | opcode_is_shift_bit | bit_shift_mode_arith | shift_val_non_zero_n | opcode_is_cmp_group | opcode_is_sub_group | opcode_is_add_group | opcode_is_xor_group | opcode_is_and_group | opcode_is_move_r0_sp | bit_shift_mode_x_rot | bit_shift_mode_rot_n | opcode_is_move_sp_r0 | bit_shift_mode_test_n | opcode_is_logic_group | opcode_is_stack_group | opcode_is_addq_group | is_simple_data_transfer | is_not_interrupting_end | opcode_is_mul_sqrt_div | opcode_is_branch_group | opcode_is_postinc_group | opcode_is_absolute_group | opcode_is_indirect_group | ldi_x_state_0_byte_1_word | opcode_is_indirect_postinc | opcode_is_stack_rel_group | + | - | + | + | - | + | - | 1 | + | + | Ext / Int | 1 | If IMMEDIATE group / use instr 2:3 to give / BIT or SHIFT | Decode H 2:3 to give / BIT / SHIFT mode. | Decode Opcode | flag_F6 | flag_I | state_7 | state_5 | state_3 | state_2 | state_1 | state_0 | instr_7_n | instr_6_n | instr_3_n | instr_2_n | instr_7 | instr_6 | instr_5 | instr_4 | instr_3 | instr_2 | instr_1 | instr_0 | R1_is_z | H_7 | H_6 | H_4 | H_3 | H_2 | H_1 | H_0 | Here we first split the opcode to determine / the instruction. We then start combining / this with the current state and status to / help the later decoding stages. | PS | instr | H | Rn_arith_flags | state